# EAGLE design uac (EAGLE 6.5.0)
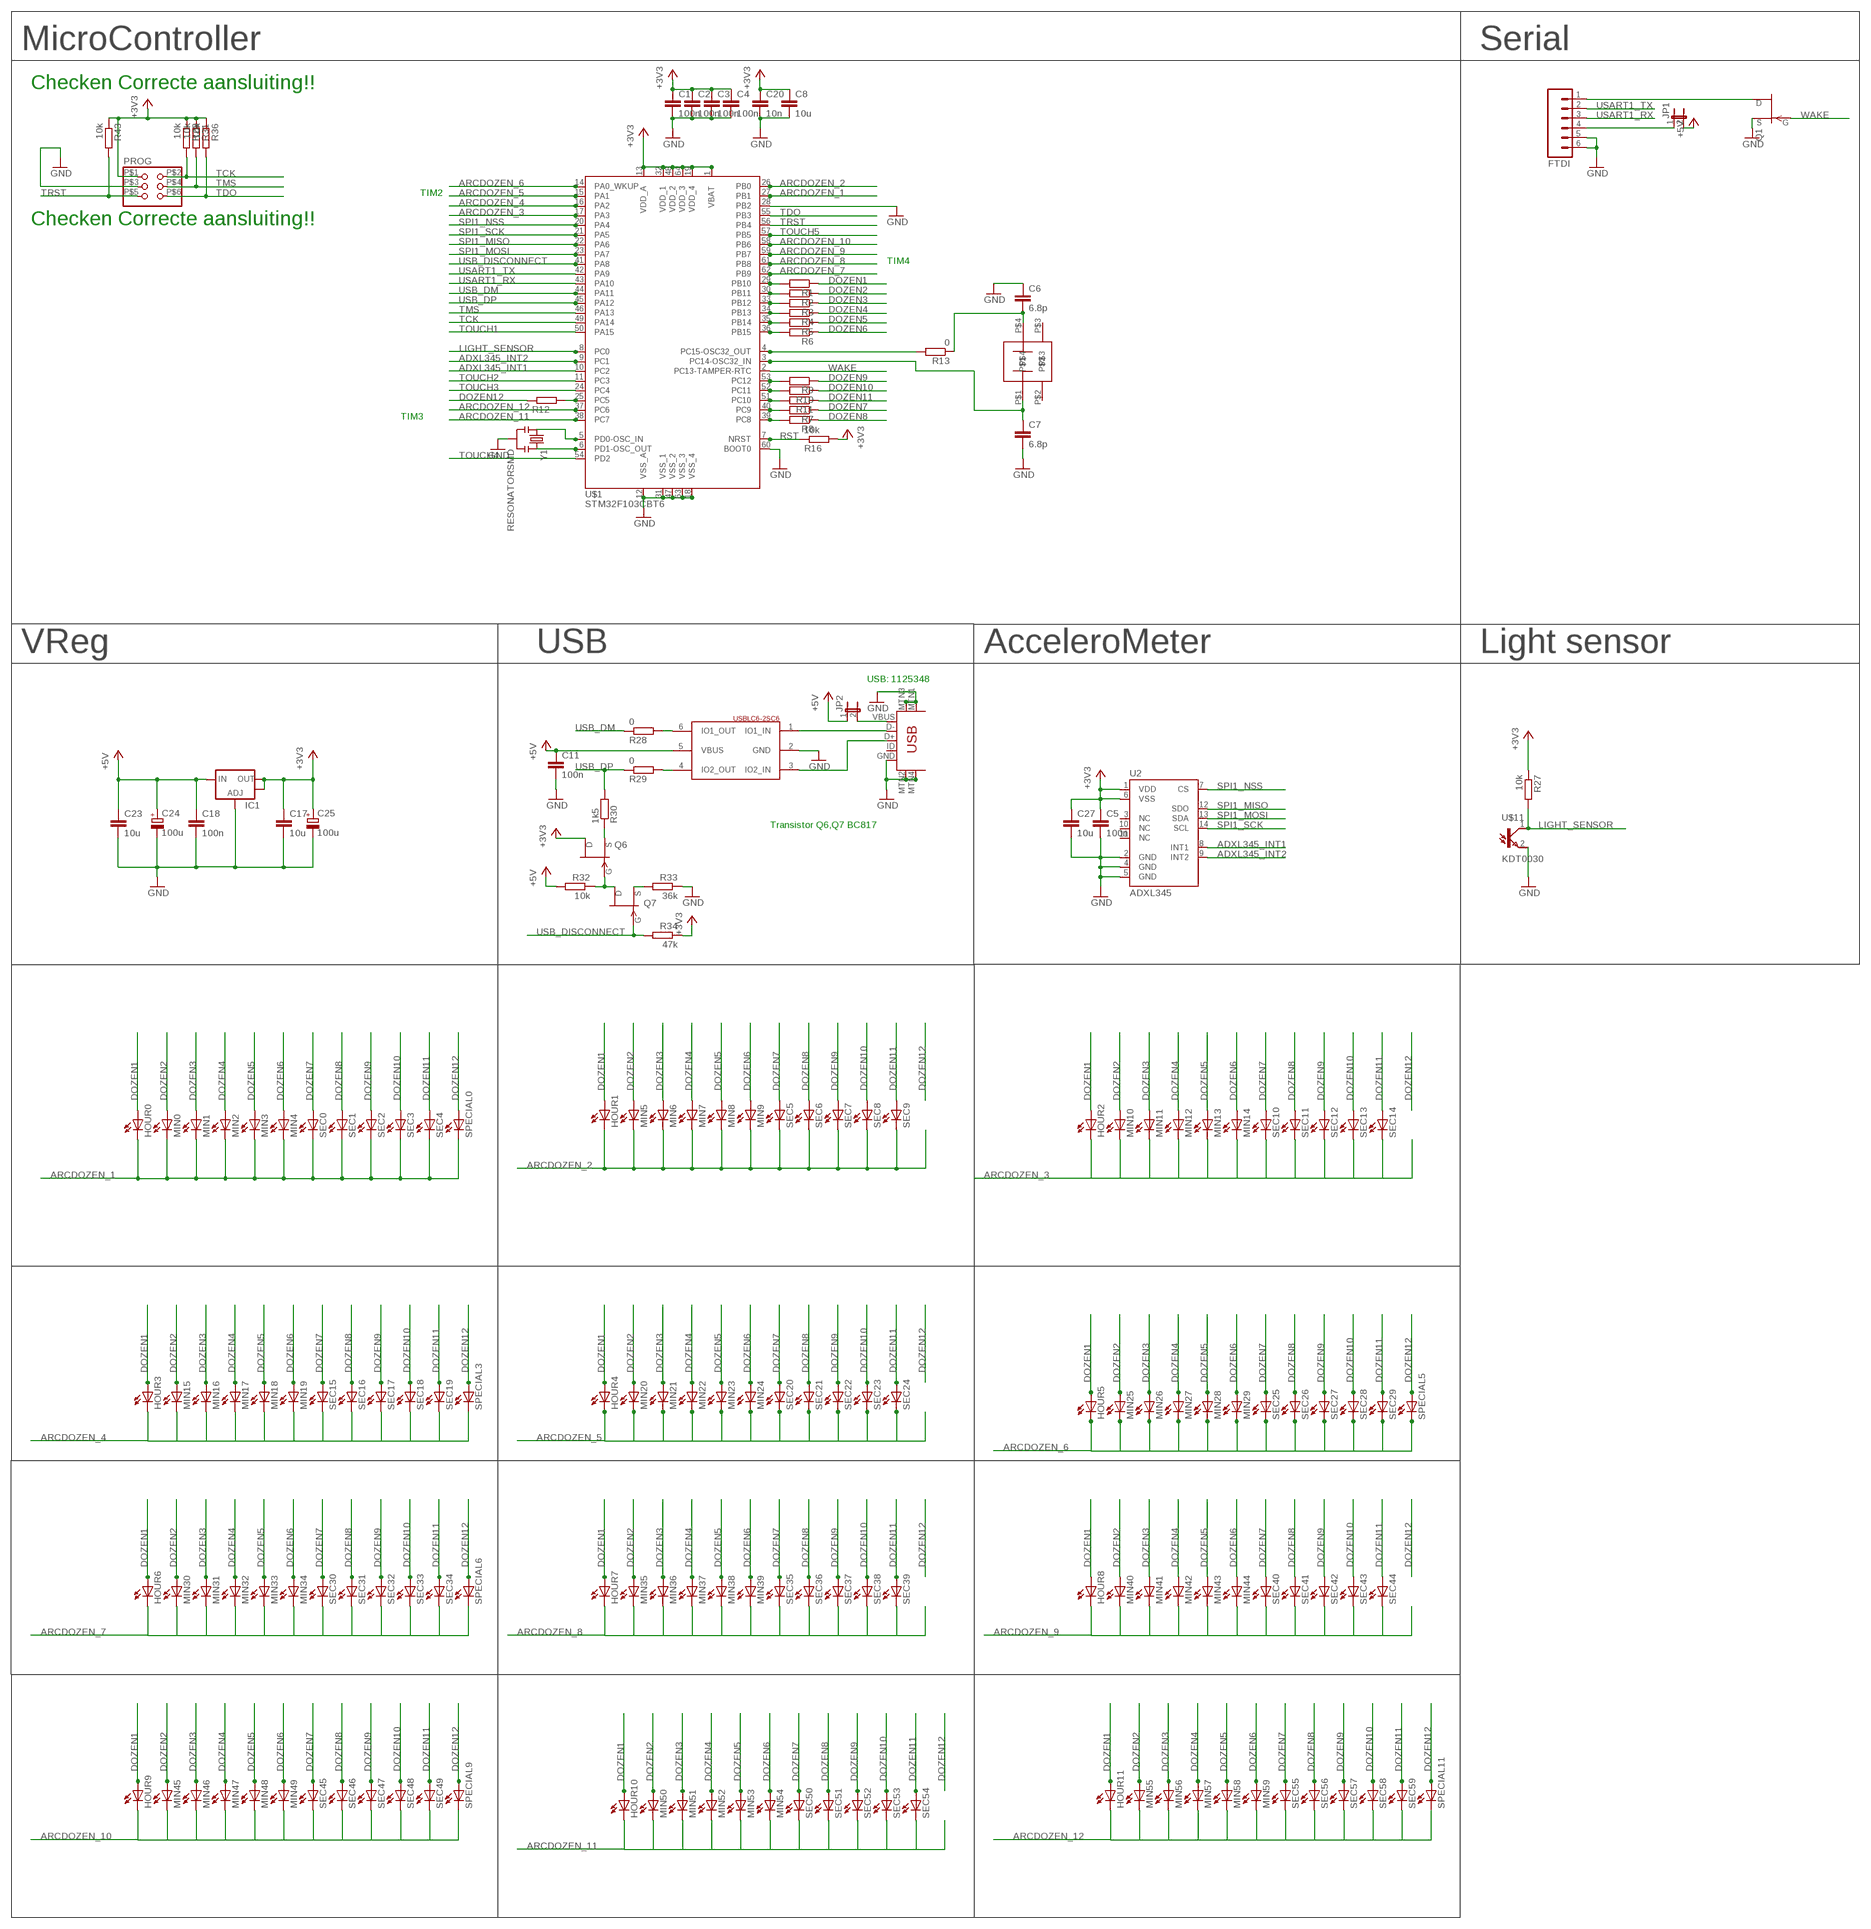
[diagram p0: schematic, sheet 1]

## Parts
C1  100n  C-EUC0603  [C0603]
C2  100n  C-EUC0603  [C0603]
C3  100n  C-EUC0603  [C0603]
C4  100n  C-EUC0603  [C0603]
C5  100n  C-EUC0603  [C0603]
C6  6.8p  C-EUC0603  [C0603]
C7  6.8p  C-EUC0603  [C0603]
C8  10u  C-EUC0603  [C0603]
C11  100n  C-EUC0603  [C0603]
C17  10u  C-EUC0603  [C0603]
C18  100n  C-EUC0603  [C0603]
C20  10n  C-EUC0603  [C0603]
C23  10u  C-EUC0603  [C0603]
C24  100u  CPOL-EUSMCC  [SMC_C]
C25  100u  CPOL-EUSMCC  [SMC_C]
C27  10u  C-EUC0603  [C0603]
FTDI  M06SMD  [1X06-SMD]
HOUR0  LEDCHIPLED_0603  [CHIPLED_0603]
HOUR1  LEDCHIPLED_0603  [CHIPLED_0603]
HOUR2  LEDCHIPLED_0603  [CHIPLED_0603]
HOUR3  LEDCHIPLED_0603  [CHIPLED_0603]
HOUR4  LEDCHIPLED_0603  [CHIPLED_0603]
HOUR5  LEDCHIPLED_0603  [CHIPLED_0603]
HOUR6  LEDCHIPLED_0603  [CHIPLED_0603]
HOUR7  LEDCHIPLED_0603  [CHIPLED_0603]
HOUR8  LEDCHIPLED_0603  [CHIPLED_0603]
HOUR9  LEDCHIPLED_0603  [CHIPLED_0603]
HOUR10  LEDCHIPLED_0603  [CHIPLED_0603]
HOUR11  LEDCHIPLED_0603  [CHIPLED_0603]
IC1  V_REG_LM1117SOT223  [SOT223]
JP1  JUMPER-2SMD-NO  [SJ_2S-NO]
JP2  JUMPER-2SMD-NO  [SJ_2S-NO]
MIN0  LEDCHIPLED_0603  [CHIPLED_0603]
MIN1  LEDCHIPLED_0603  [CHIPLED_0603]
MIN2  LEDCHIPLED_0603  [CHIPLED_0603]
MIN3  LEDCHIPLED_0603  [CHIPLED_0603]
MIN4  LEDCHIPLED_0603  [CHIPLED_0603]
MIN5  LEDCHIPLED_0603  [CHIPLED_0603]
MIN6  LEDCHIPLED_0603  [CHIPLED_0603]
MIN7  LEDCHIPLED_0603  [CHIPLED_0603]
MIN8  LEDCHIPLED_0603  [CHIPLED_0603]
MIN9  LEDCHIPLED_0603  [CHIPLED_0603]
MIN10  LEDCHIPLED_0603  [CHIPLED_0603]
MIN11  LEDCHIPLED_0603  [CHIPLED_0603]
MIN12  LEDCHIPLED_0603  [CHIPLED_0603]
MIN13  LEDCHIPLED_0603  [CHIPLED_0603]
MIN14  LEDCHIPLED_0603  [CHIPLED_0603]
MIN15  LEDCHIPLED_0603  [CHIPLED_0603]
MIN16  LEDCHIPLED_0603  [CHIPLED_0603]
MIN17  LEDCHIPLED_0603  [CHIPLED_0603]
MIN18  LEDCHIPLED_0603  [CHIPLED_0603]
MIN19  LEDCHIPLED_0603  [CHIPLED_0603]
MIN20  LEDCHIPLED_0603  [CHIPLED_0603]
MIN21  LEDCHIPLED_0603  [CHIPLED_0603]
MIN22  LEDCHIPLED_0603  [CHIPLED_0603]
MIN23  LEDCHIPLED_0603  [CHIPLED_0603]
MIN24  LEDCHIPLED_0603  [CHIPLED_0603]
MIN25  LEDCHIPLED_0603  [CHIPLED_0603]
MIN26  LEDCHIPLED_0603  [CHIPLED_0603]
MIN27  LEDCHIPLED_0603  [CHIPLED_0603]
MIN28  LEDCHIPLED_0603  [CHIPLED_0603]
MIN29  LEDCHIPLED_0603  [CHIPLED_0603]
MIN30  LEDCHIPLED_0603  [CHIPLED_0603]
MIN31  LEDCHIPLED_0603  [CHIPLED_0603]
MIN32  LEDCHIPLED_0603  [CHIPLED_0603]
MIN33  LEDCHIPLED_0603  [CHIPLED_0603]
MIN34  LEDCHIPLED_0603  [CHIPLED_0603]
MIN35  LEDCHIPLED_0603  [CHIPLED_0603]
MIN36  LEDCHIPLED_0603  [CHIPLED_0603]
MIN37  LEDCHIPLED_0603  [CHIPLED_0603]
MIN38  LEDCHIPLED_0603  [CHIPLED_0603]
MIN39  LEDCHIPLED_0603  [CHIPLED_0603]
MIN40  LEDCHIPLED_0603  [CHIPLED_0603]
MIN41  LEDCHIPLED_0603  [CHIPLED_0603]
MIN42  LEDCHIPLED_0603  [CHIPLED_0603]
MIN43  LEDCHIPLED_0603  [CHIPLED_0603]
MIN44  LEDCHIPLED_0603  [CHIPLED_0603]
MIN45  LEDCHIPLED_0603  [CHIPLED_0603]
MIN46  LEDCHIPLED_0603  [CHIPLED_0603]
MIN47  LEDCHIPLED_0603  [CHIPLED_0603]
MIN48  LEDCHIPLED_0603  [CHIPLED_0603]
MIN49  LEDCHIPLED_0603  [CHIPLED_0603]
MIN50  LEDCHIPLED_0603  [CHIPLED_0603]
MIN51  LEDCHIPLED_0603  [CHIPLED_0603]
MIN52  LEDCHIPLED_0603  [CHIPLED_0603]
MIN53  LEDCHIPLED_0603  [CHIPLED_0603]
MIN54  LEDCHIPLED_0603  [CHIPLED_0603]
MIN55  LEDCHIPLED_0603  [CHIPLED_0603]
MIN56  LEDCHIPLED_0603  [CHIPLED_0603]
MIN57  LEDCHIPLED_0603  [CHIPLED_0603]
MIN58  LEDCHIPLED_0603  [CHIPLED_0603]
MIN59  LEDCHIPLED_0603  [CHIPLED_0603]
PROG  PINHD-2X3SMT  [2X03_SMT]
Q1  2N7002CK4SST  [SOT23]
Q6  2N7002CK4SST  [SOT23]
Q7  2N7002CK4SST  [SOT23]
R1  R-EU_R0603  [R0603]
R2  R-EU_R0603  [R0603]
R3  R-EU_R0603  [R0603]
R4  R-EU_R0603  [R0603]
R5  R-EU_R0603  [R0603]
R6  R-EU_R0603  [R0603]
R7  R-EU_R0603  [R0603]
R8  R-EU_R0603  [R0603]
R9  R-EU_R0603  [R0603]
R10  R-EU_R0603  [R0603]
R11  R-EU_R0603  [R0603]
R12  R-EU_R0603  [R0603]
R13  0  R-EU_R0603  [R0603]
R16  10k  R-EU_R0603  [R0603]
R23  10k  R-EU_R0603  [R0603]
R27  10k  R-EU_R0603  [R0603]
R28  0  R-EU_R0603  [R0603]
R29  0  R-EU_R0603  [R0603]
R30  1k5  R-EU_R0603  [R0603]
R31  10k  R-EU_R0603  [R0603]
R32  10k  R-EU_R0603  [R0603]
R33  36k  R-EU_R0603  [R0603]
R34  47k  R-EU_R0603  [R0603]
R36  10k  R-EU_R0603  [R0603]
R43  10k  R-EU_R0603  [R0603]
SEC0  LEDCHIPLED_0603  [CHIPLED_0603]
SEC1  LEDCHIPLED_0603  [CHIPLED_0603]
SEC2  LEDCHIPLED_0603  [CHIPLED_0603]
SEC3  LEDCHIPLED_0603  [CHIPLED_0603]
SEC4  LEDCHIPLED_0603  [CHIPLED_0603]
SEC5  LEDCHIPLED_0603  [CHIPLED_0603]
SEC6  LEDCHIPLED_0603  [CHIPLED_0603]
SEC7  LEDCHIPLED_0603  [CHIPLED_0603]
SEC8  LEDCHIPLED_0603  [CHIPLED_0603]
SEC9  LEDCHIPLED_0603  [CHIPLED_0603]
SEC10  LEDCHIPLED_0603  [CHIPLED_0603]
SEC11  LEDCHIPLED_0603  [CHIPLED_0603]
SEC12  LEDCHIPLED_0603  [CHIPLED_0603]
SEC13  LEDCHIPLED_0603  [CHIPLED_0603]
SEC14  LEDCHIPLED_0603  [CHIPLED_0603]
SEC15  LEDCHIPLED_0603  [CHIPLED_0603]
SEC16  LEDCHIPLED_0603  [CHIPLED_0603]
SEC17  LEDCHIPLED_0603  [CHIPLED_0603]
SEC18  LEDCHIPLED_0603  [CHIPLED_0603]
SEC19  LEDCHIPLED_0603  [CHIPLED_0603]
SEC20  LEDCHIPLED_0603  [CHIPLED_0603]
SEC21  LEDCHIPLED_0603  [CHIPLED_0603]
SEC22  LEDCHIPLED_0603  [CHIPLED_0603]
SEC23  LEDCHIPLED_0603  [CHIPLED_0603]
SEC24  LEDCHIPLED_0603  [CHIPLED_0603]
SEC25  LEDCHIPLED_0603  [CHIPLED_0603]
SEC26  LEDCHIPLED_0603  [CHIPLED_0603]
SEC27  LEDCHIPLED_0603  [CHIPLED_0603]
SEC28  LEDCHIPLED_0603  [CHIPLED_0603]
SEC29  LEDCHIPLED_0603  [CHIPLED_0603]
SEC30  LEDCHIPLED_0603  [CHIPLED_0603]
SEC31  LEDCHIPLED_0603  [CHIPLED_0603]
SEC32  LEDCHIPLED_0603  [CHIPLED_0603]
SEC33  LEDCHIPLED_0603  [CHIPLED_0603]
SEC34  LEDCHIPLED_0603  [CHIPLED_0603]
SEC35  LEDCHIPLED_0603  [CHIPLED_0603]
SEC36  LEDCHIPLED_0603  [CHIPLED_0603]
SEC37  LEDCHIPLED_0603  [CHIPLED_0603]
SEC38  LEDCHIPLED_0603  [CHIPLED_0603]
SEC39  LEDCHIPLED_0603  [CHIPLED_0603]
SEC40  LEDCHIPLED_0603  [CHIPLED_0603]
SEC41  LEDCHIPLED_0603  [CHIPLED_0603]
SEC42  LEDCHIPLED_0603  [CHIPLED_0603]
SEC43  LEDCHIPLED_0603  [CHIPLED_0603]
SEC44  LEDCHIPLED_0603  [CHIPLED_0603]
SEC45  LEDCHIPLED_0603  [CHIPLED_0603]
SEC46  LEDCHIPLED_0603  [CHIPLED_0603]
SEC47  LEDCHIPLED_0603  [CHIPLED_0603]
SEC48  LEDCHIPLED_0603  [CHIPLED_0603]
SEC49  LEDCHIPLED_0603  [CHIPLED_0603]
SEC50  LEDCHIPLED_0603  [CHIPLED_0603]
SEC51  LEDCHIPLED_0603  [CHIPLED_0603]
SEC52  LEDCHIPLED_0603  [CHIPLED_0603]
SEC53  LEDCHIPLED_0603  [CHIPLED_0603]
SEC54  LEDCHIPLED_0603  [CHIPLED_0603]
SEC55  LEDCHIPLED_0603  [CHIPLED_0603]
SEC56  LEDCHIPLED_0603  [CHIPLED_0603]
SEC57  LEDCHIPLED_0603  [CHIPLED_0603]
SEC58  LEDCHIPLED_0603  [CHIPLED_0603]
SEC59  LEDCHIPLED_0603  [CHIPLED_0603]
SPECIAL0  LEDCHIPLED_0603  [CHIPLED_0603]
SPECIAL3  LEDCHIPLED_0603  [CHIPLED_0603]
SPECIAL5  LEDCHIPLED_0603  [CHIPLED_0603]
SPECIAL6  LEDCHIPLED_0603  [CHIPLED_0603]
SPECIAL9  LEDCHIPLED_0603  [CHIPLED_0603]
SPECIAL11  LEDCHIPLED_0603  [CHIPLED_0603]
U2  ADXL345  [LGA14]
U$1  STM32F103CBT6  [LQFP64]
U$2  CRYSTAL_32KHZ  [CRYSTAL_32KHZ]
U$11  KDT0030  [FLD00030]
U$12  USB-MINIB-5PIN  [USB-MINIB]
U$13  USBLC6-2SC6  [SOT23]
Y1  RESONATORSMD  [RESONATOR-SMD]

## Nets
+3V3: C1.1 C2.1 C3.1 C4.1 C5.1 C8.1 C17.1 C20.1 C25.+ C27.1 IC1.2(OUT) IC1.4(OUT) PROG.P$1 Q6.3(D) R16.2 R23.1 R27.1 R31.1 R34.1 R36.1 R43.1 U2.1(VDD) U2.6(VSS) U$1.1(VBAT) U$1.13(VDD_A) U$1.19(VDD_4) U$1.32(VDD_1) U$1.48(VDD_2) U$1.64(VDD_3)
+5V: C11.1 C18.1 C23.1 C24.+ IC1.3(IN) JP1.2 JP2.1 R32.2 U$13.5(VBUS)
ADXL345_INT1: U2.8(INT1) U$1.10(PC2)
ADXL345_INT2: U2.9(INT2) U$1.9(PC1)
ARCDOZEN_1: HOUR0.C MIN0.C MIN1.C MIN2.C MIN3.C MIN4.C SEC0.C SEC1.C SEC2.C SEC3.C SEC4.C SPECIAL0.C U$1.27(PB1)
ARCDOZEN_2: HOUR1.C MIN5.C MIN6.C MIN7.C MIN8.C MIN9.C SEC5.C SEC6.C SEC7.C SEC8.C SEC9.C U$1.26(PB0)
ARCDOZEN_3: HOUR2.C MIN10.C MIN11.C MIN12.C MIN13.C MIN14.C SEC10.C SEC11.C SEC12.C SEC13.C SEC14.C U$1.17(PA3)
ARCDOZEN_4: HOUR3.C MIN15.C MIN16.C MIN17.C MIN18.C MIN19.C SEC15.C SEC16.C SEC17.C SEC18.C SEC19.C SPECIAL3.C U$1.16(PA2)
ARCDOZEN_5: HOUR4.C MIN20.C MIN21.C MIN22.C MIN23.C MIN24.C SEC20.C SEC21.C SEC22.C SEC23.C SEC24.C U$1.15(PA1)
ARCDOZEN_6: HOUR5.C MIN25.C MIN26.C MIN27.C MIN28.C MIN29.C SEC25.C SEC26.C SEC27.C SEC28.C SEC29.C SPECIAL5.C U$1.14(PA0_WKUP)
ARCDOZEN_7: HOUR6.C MIN30.C MIN31.C MIN32.C MIN33.C MIN34.C SEC30.C SEC31.C SEC32.C SEC33.C SEC34.C SPECIAL6.C U$1.62(PB9)
ARCDOZEN_8: HOUR7.C MIN35.C MIN36.C MIN37.C MIN38.C MIN39.C SEC35.C SEC36.C SEC37.C SEC38.C SEC39.C U$1.61(PB8)
ARCDOZEN_9: HOUR8.C MIN40.C MIN41.C MIN42.C MIN43.C MIN44.C SEC40.C SEC41.C SEC42.C SEC43.C SEC44.C U$1.59(PB7)
ARCDOZEN_10: HOUR9.C MIN45.C MIN46.C MIN47.C MIN48.C MIN49.C SEC45.C SEC46.C SEC47.C SEC48.C SEC49.C SPECIAL9.C U$1.58(PB6)
ARCDOZEN_11: HOUR10.C MIN50.C MIN51.C MIN52.C MIN53.C MIN54.C SEC50.C SEC51.C SEC52.C SEC53.C SEC54.C U$1.38(PC7)
ARCDOZEN_12: HOUR11.C MIN55.C MIN56.C MIN57.C MIN58.C MIN59.C SEC55.C SEC56.C SEC57.C SEC58.C SEC59.C SPECIAL11.C U$1.37(PC6)
DOZEN1: HOUR0.A HOUR1.A HOUR2.A HOUR3.A HOUR4.A HOUR5.A HOUR6.A HOUR7.A HOUR8.A HOUR9.A HOUR10.A HOUR11.A R1.1
DOZEN2: MIN0.A MIN5.A MIN10.A MIN15.A MIN20.A MIN25.A MIN30.A MIN35.A MIN40.A MIN45.A MIN50.A MIN55.A R2.1
DOZEN3: MIN1.A MIN6.A MIN11.A MIN16.A MIN21.A MIN26.A MIN31.A MIN36.A MIN41.A MIN46.A MIN51.A MIN56.A R3.1
DOZEN4: MIN2.A MIN7.A MIN12.A MIN17.A MIN22.A MIN27.A MIN32.A MIN37.A MIN42.A MIN47.A MIN52.A MIN57.A R4.1
DOZEN5: MIN3.A MIN8.A MIN13.A MIN18.A MIN23.A MIN28.A MIN33.A MIN38.A MIN43.A MIN48.A MIN53.A MIN58.A R5.1
DOZEN6: MIN4.A MIN9.A MIN14.A MIN19.A MIN24.A MIN29.A MIN34.A MIN39.A MIN44.A MIN49.A MIN54.A MIN59.A R6.1
DOZEN7: R7.1 SEC0.A SEC5.A SEC10.A SEC15.A SEC20.A SEC25.A SEC30.A SEC35.A SEC40.A SEC45.A SEC50.A SEC55.A
DOZEN8: R8.1 SEC1.A SEC6.A SEC11.A SEC16.A SEC21.A SEC26.A SEC31.A SEC36.A SEC41.A SEC46.A SEC51.A SEC56.A
DOZEN9: R9.1 SEC2.A SEC7.A SEC12.A SEC17.A SEC22.A SEC27.A SEC32.A SEC37.A SEC42.A SEC47.A SEC52.A SEC57.A
DOZEN10: R10.1 SEC3.A SEC8.A SEC13.A SEC18.A SEC23.A SEC28.A SEC33.A SEC38.A SEC43.A SEC48.A SEC53.A SEC58.A
DOZEN11: R11.1 SEC4.A SEC9.A SEC14.A SEC19.A SEC24.A SEC29.A SEC34.A SEC39.A SEC44.A SEC49.A SEC54.A SEC59.A
DOZEN12: R12.1 SPECIAL0.A SPECIAL3.A SPECIAL5.A SPECIAL6.A SPECIAL9.A SPECIAL11.A
GND: C1.2 C2.2 C3.2 C4.2 C5.2 C6.1 C7.2 C8.2 C11.2 C17.2 C18.2 C20.2 C23.2 C24.- C25.- C27.2 FTDI.5 FTDI.6 IC1.1(ADJ) PROG.P$3 Q1.2(S) R33.1 U2.2(GND) U2.4(GND) U2.5(GND) U$1.12(VSS_A) U$1.18(VSS_4) U$1.28(PB2) U$1.31(VSS_1) U$1.47(VSS_2) U$1.60(BOOT0) U$1.63(VSS_3) U$11.2(EMI) U$12.GND U$12.MTN1(MTN2) U$12.MTN2(MTN3) U$12.MTN3(MTN1) U$12.MTN4 U$13.2(GND) Y1.2
LIGHT_SENSOR: R27.2 U$1.8(PC0) U$11.1(COL)
N$1: U$1.6(PD1-OSC_OUT) Y1.3
N$2: U$1.5(PD0-OSC_IN) Y1.1
N$3: JP2.2 U$12.VBUS
N$4: R13.2 U$1.4(PC15-OSC32_OUT)
N$5: C6.2 R13.1 U$2.P$4
N$6: C7.1 U$1.3(PC14-OSC32_IN) U$2.P$1
N$7: R1.2 U$1.29(PB10)
N$8: R2.2 U$1.30(PB11)
N$9: R3.2 U$1.33(PB12)
N$10: R4.2 U$1.34(PB13)
N$11: R5.2 U$1.35(PB14)
N$12: R6.2 U$1.36(PB15)
N$13: R7.2 U$1.40(PC9)
N$14: R8.2 U$1.39(PC8)
N$15: R9.2 U$1.53(PC12)
N$16: R10.2 U$1.52(PC11)
N$17: R11.2 U$1.51(PC10)
N$18: U$12.D- U$13.1(IO1_IN)
N$19: FTDI.4 JP1.1
N$20: FTDI.1 Q1.3(D)
N$34: U$12.D+ U$13.3(IO2_IN)
N$35: R12.2 U$1.25(PC5)
N$36: R28.2 U$13.6(IO1_OUT)
N$37: R29.2 U$13.4(IO2_OUT)
N$38: Q6.2(S) R30.1
N$39: Q6.1(G) Q7.3(D) R32.1
N$40: Q7.2(S) R33.2
RST: R16.1 U$1.7(NRST)
SPI1_MISO: U2.12(SDO) U$1.22(PA6)
SPI1_MOSI: U2.13(SDA) U$1.23(PA7)
SPI1_NSS: U2.7(CS) U$1.20(PA4)
SPI1_SCK: U2.14(SCL) U$1.21(PA5)
TCK: PROG.P$2 R23.2 U$1.49(PA14)
TDO: PROG.P$6 R36.2 U$1.55(PB3)
TMS: PROG.P$4 R31.2 U$1.46(PA13)
TOUCH1: U$1.50(PA15)
TOUCH2: U$1.11(PC3)
TOUCH3: U$1.24(PC4)
TOUCH4: U$1.54(PD2)
TOUCH5: U$1.57(PB5)
TRST: PROG.P$5 R43.2 U$1.56(PB4)
USART1_RX: FTDI.3 U$1.43(PA10)
USART1_TX: FTDI.2 U$1.42(PA9)
USB_DISCONNECT: Q7.1(G) R34.2 U$1.41(PA8)
USB_DM: R28.1 U$1.44(PA11)
USB_DP: R29.1 R30.2 U$1.45(PA12)
WAKE: Q1.1(G) U$1.2(PC13-TAMPER-RTC)
Unconnected: U2.3(NC) U2.10(NC) U2.11(NC) U$2.P$2 U$2.P$3 U$12.ID

## Notes on the sheet
- MicroController | Serial
- Checken Correcte aansluiting!!
- TIM2
- Checken Correcte aansluiting!!
- TIM4
- TIM3
- VReg | USB | AcceleroMeter | Light sensor
- USB: 1125348
- Transistor Q6,Q7 BC817

## Library data of the parts
C1-C8 C11 C17 C18 C20 C23 C27 = Custom components:C-EU: CAPACITOR, European symbol
C24 C25 = Custom components:CPOL-EU: POLARIZED CAPACITOR, European symbol
FTDI = Custom components:M06: Header 6 Standard 6-pin 0.1" header. Use with straight break away headers (SKU : PRT-00116), right angle break away headers (PRT-00553), swiss pins (PRT-00743), machine pins (PRT-00117), and female headers (PRT-00115). Molex polarized connector foot print use with SKU : PRT-08094 with associated crimp pins and housings. NOTES ON THE VARIANTS LOCK and LOCK_LONGPADS... This footprint was designed to help hold the alignment of a through-hole component (i.e. 6-pin header) while soldering it into place. You may notice that each hole has been shifted either up or down by 0.005 of an inch from it's more standard position (which is a perfectly straight line). This slight alteration caused the pins (the squares in the middle) to touch the edges of the holes. Because they are alternating, it causes a "brace" to hold the component in place. 0.005 has proven to be the perfect amount of "off-center" position when using our standard breakaway headers. Although looks a little odd when you look at the bare footprint, once you have a header in there, the alteration is very hard to notice. Also, if you push a header all the way into place, it is covered up entirely on the bottom side. This idea of altering the position of holes to aid alignment will be further integrated into the Sparkfun Library for other footprints. It can help hold any component with 3 or more connection pins.
HOUR0 HOUR1-HOUR11 MIN0 MIN1-MIN59 SEC0 SEC1-SEC59 SPECIAL0 SPECIAL3 SPECIAL5 SPECIAL6 SPECIAL9 SPECIAL11 = timearc:LED: LED OSRAM: - CHIPLED LG R971, LG N971, LY N971, LG Q971, LY Q971, LO R971, LY R971 LH N974, LH R974 LS Q976, LO Q976, LY Q976 LO Q996 - Hyper CHIPLED LW Q18S LB Q993, LB Q99A, LB R99A - SideLED LS A670, LO A670, LY A670, LG A670, LP A670 LB A673, LV A673, LT A673, LW A673 LH A674 LY A675 LS A676, LA A676, LO A676, LY A676, LW A676 LS A679, LY A679, LG A679 - Hyper Micro SIDELED® LS Y876, LA Y876, LO Y876, LY Y876 LT Y87S - SmartLED LW L88C, LW L88S LB L89C, LB L89S, LG L890 LS L89K, LO L89K, LY L89K LS L896, LA L896, LO L896, LY L896 - TOPLED LS T670, LO T670, LY T670, LG T670, LP T670 LSG T670, LSP T670, LSY T670, LOP T670, LYG T670 LG T671, LOG T671, LSG T671 LB T673, LV T673, LT T673, LW T673 LH T674 LS T676, LA T676, LO T676, LY T676, LB T676, LH T676, LSB T676, LW T676 LB T67C, LV T67C, LT T67C, LS T67K, LO T67K, LY T67K, LW E67C LS E67B, LA E67B, LO E67B, LY E67B, LB E67C, LV E67C, LT E67C LW T67C LS T679, LY T679, LG T679 LS T770, LO T770, LY T770, LG T770, LP T770 LB T773, LV T773, LT T773, LW T773 LH T774 LS E675, LA E675, LY E675, LS T675 LS T776, LA T776, LO T776, LY T776, LB T776 LHGB T686 LT T68C, LB T68C - Hyper Mini TOPLED® LB M676 - Mini TOPLED Santana® LG M470 LS M47K, LO M47K, LY M47K Source: http://www.osram.convergy.de LUXEON: - LUMILED® LXK2-PW12-R00, LXK2-PW12-S00, LXK2-PW14-U00, LXK2-PW14-V00 LXK2-PM12-R00, LXK2-PM12-S00, LXK2-PM14-U00 LXK2-PE12-Q00, LXK2-PE12-R00, LXK2-PE12-S00, LXK2-PE14-T00, LXK2-PE14-U00 LXK2-PB12-K00, LXK2-PB12-L00, LXK2-PB12-M00, LXK2-PB14-N00, LXK2-PB14-P00, LXK2-PB14-Q00 LXK2-PR12-L00, LXK2-PR12-M00, LXK2-PR14-Q00, LXK2-PR14-R00 LXK2-PD12-Q00, LXK2-PD12-R00, LXK2-PD12-S00 LXK2-PH12-R00, LXK2-PH12-S00 LXK2-PL12-P00, LXK2-PL12-Q00, LXK2-PL12-R00 Source: www.luxeon.com KINGBRIGHT: KA-3528ASYC Source: www.kingbright.com
IC1 = Custom components:V_REG_LM1117: Voltage Regulator LM1117 Standard adjustable voltage regulator but in SMD form. Spark Fun Electronics SKU : COM-00595
JP1 JP2 = SparkFun2012:JUMPER-2: Jumper Basic 0.1" spaced jumper. Use with breakaway headers.
PROG = Custom components:PINHD-2X3: PIN HEADER
Q1 Q6 Q7 = Custom components:2N7002CK: N-Channel JFETs farnell: 1829183 Source: VISHAY 2N5484.pdf Compatible: TO92 2N5245 J304 J305 U310 J308 J309 J310 TO72 2N4416 2N4416A 2N3823 2N4351 3N169 3N170 3N171 MFE3002 TO18 2N3796 2N3797 MFE825 Source: Motorola European Master Guide Pacge 3-59
R1-R13 R16 R23 R27-R34 R36 R43 = Custom components:R-EU_: RESISTOR, European symbol
U2 = SparkFun2012:ADXL345
U$1 = timearc:STM32F103CBT6
U$2 = timearc:CRYSTAL_32KHZ; MPN: MC-306 32.768K-E3:ROHS; OC_DIGIKEY_1: SER2417TR-ND
U$11 = timearc:KDT0030: Updated Light Sensor The KDT00030 is a small, low profile photo detector. It incorporates a phototransistor detector chip which makes it an ideal choice for low cost ambient light measurement applications like mobile appliances backlighting.; MPN: KDT00030TR; OC_DIGIKEY_1000: KDT00030FSCT-ND; U_PRICE_1: 0.60 USD; U_PRICE_1000: 0.19814 USD
U$12 = SparkFun2012:USB-MINIB: Mini-USB "B" connector with 5th pin broken out. Created new symbol breaking out 5th "ID" pin in mini/micro USB connector spec. See: http://en.wikipedia.org/wiki/Mini_usb#Cables. Uses same footprint as 4-pin symbol. Also added pins to connect to mounting / shield pads if required (probably not generally needed as signals aren't shielded once they leave the connector).
U$13 = timearc:USBLC6-2SC6; MPN: USBLC6-2SC6; OC_FARNELL: 1269406
Y1 = Custom components:RESONATOR: Resonator Small SMD resonator. This is the itty bitty 10/20MHz resonators with built in caps. CSTCE10M0G55 and CSTCE20M0V53. Footprint has been reviewed closely but hasn't been tested yet.

## Net classes
0 default: width 0.152 mm, drill 0.305 mm, clearance 0.152 mm

## Board
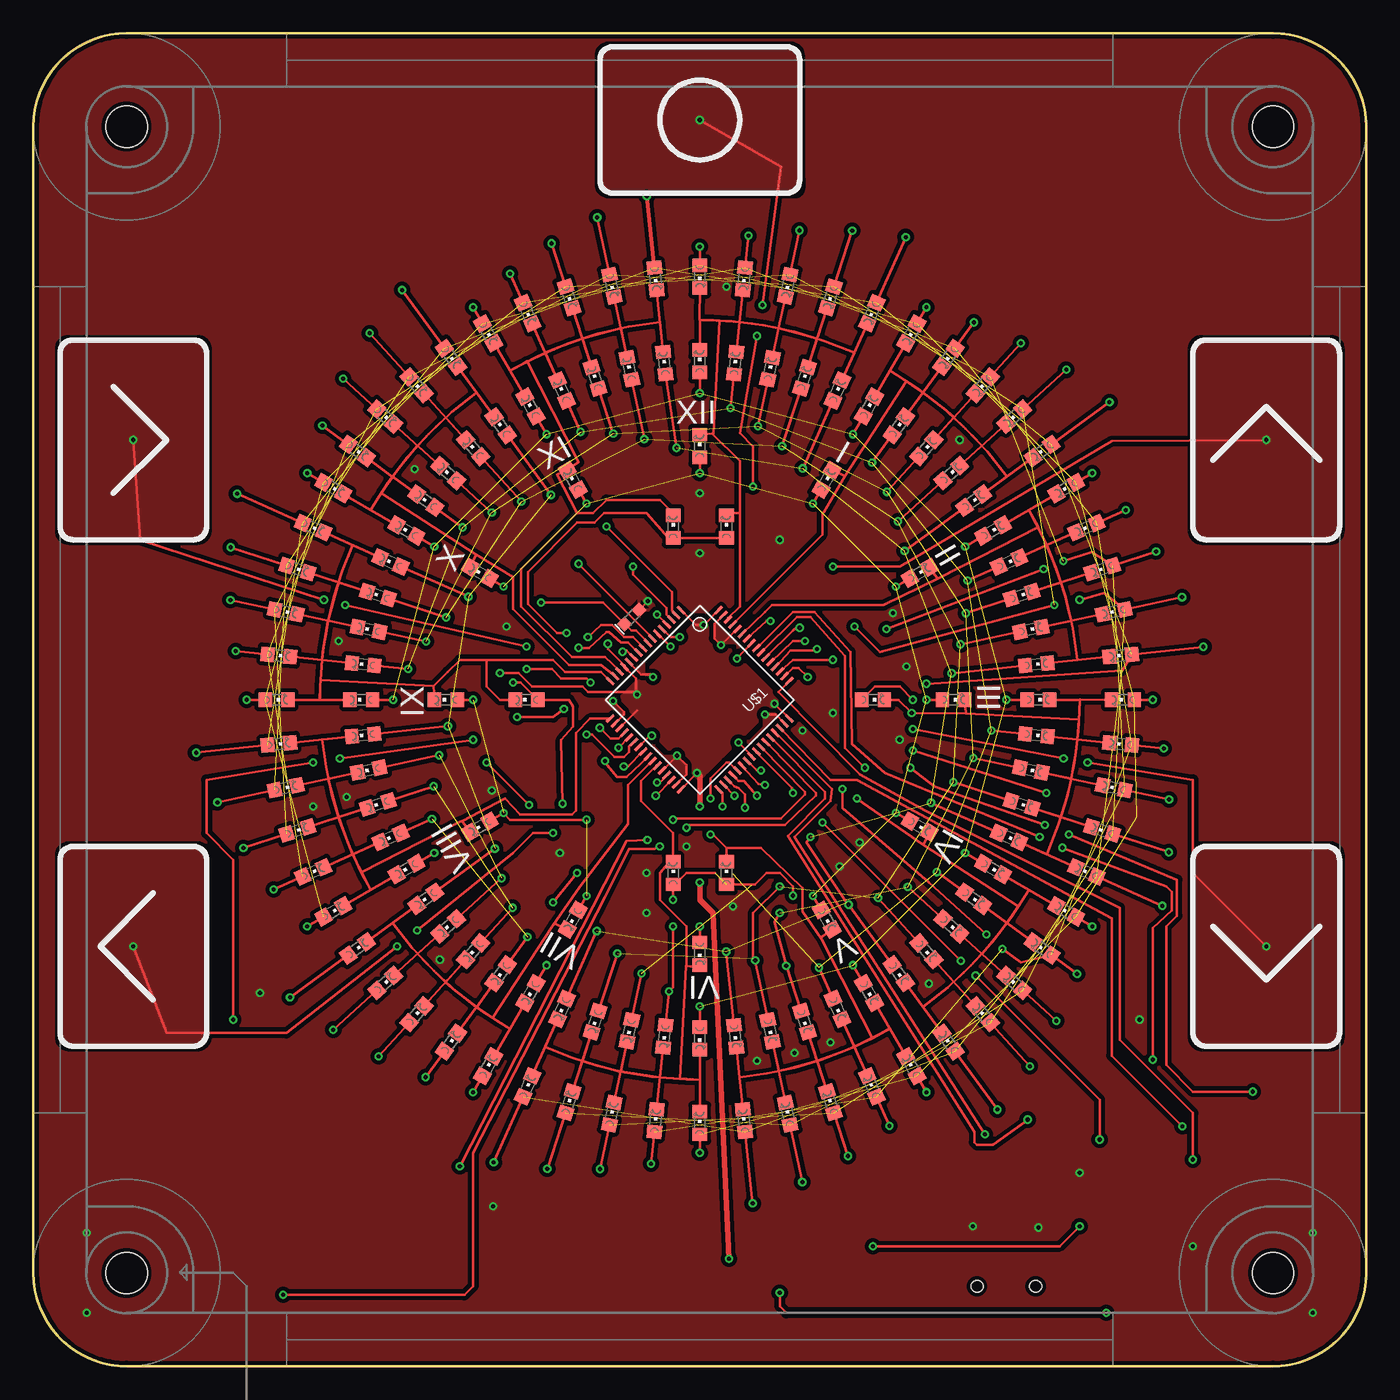
[diagram p1: board, top side]
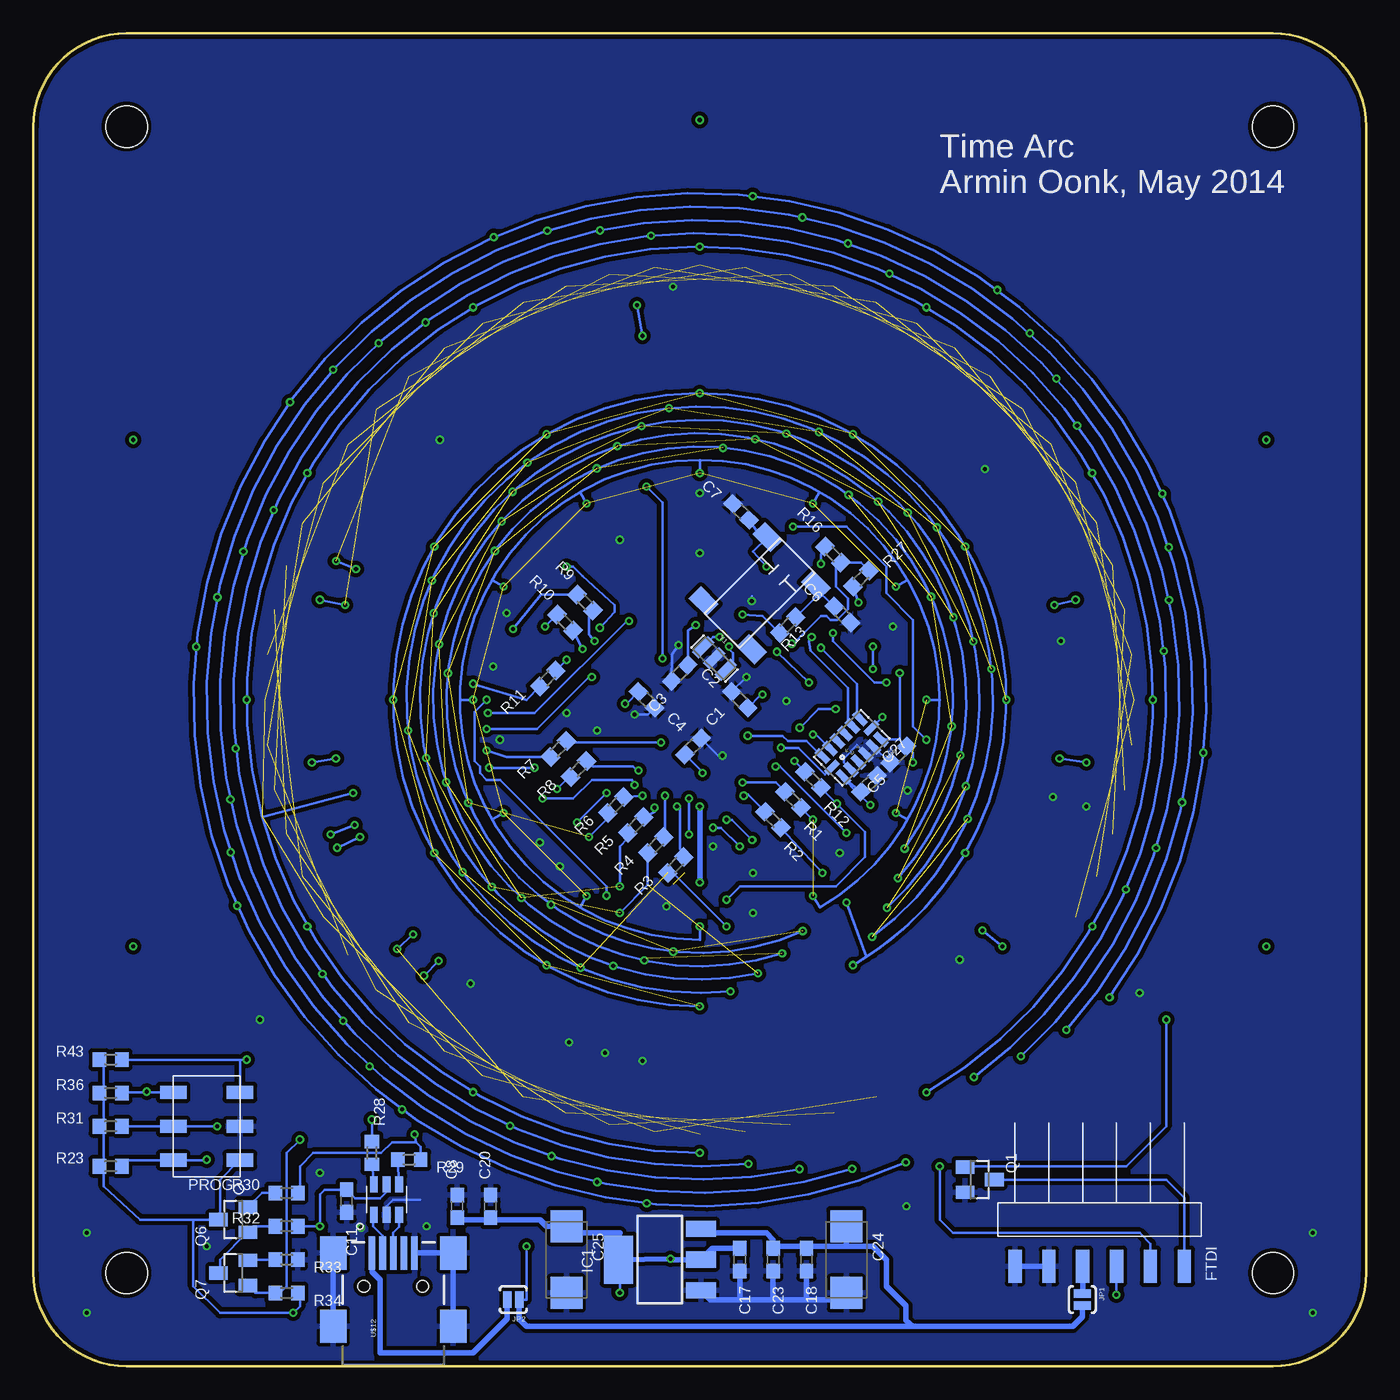
[diagram p2: board, bottom side, seen from below]

Size 100 x 100 mm. Coordinates in mm from the lower left corner, seen from the top.
Outline: 93,100 7,100 arc90 0,93 0,7 arc90 7,0 93,0 arc90 100,7 100,93 arc90 93,100
Copper layers (1*16): Top 0.035mm / dielectric 1.5mm / Bottom 0.035mm
Design rules "dirt_cheap_dirty_boards.v1": minimum track width 5mil, minimum drill 12mil, track to track 5mil, track to pad 5mil, pad to pad 5mil, via to via 5mil, smd to smd 0mil, copper to edge 10mil, drill to drill 10mil, minimum pad ring 10mil, minimum via ring 6mil, stop-mask expansion 2mil, vias tented up to drill 25mil, thermal gap 10mil
Holes 3.1 mm at 93,7 7,7 93,93 7,93

### Footprints (pad centres in the part's own frame; a part is rotated, then mirrored left to right if it is on the bottom)
C0603 = smd 1.1 x 1: 1 -0.85,0; 2 0.85,0
SMC_C = smd 2.4 x 2.4: + -2.5,0; - 2.5,0
1X06-SMD = smd 1 x 2.5: 1 6.35,-3.5; 2 3.81,-3.5; 3 1.27,-3.5; 4 -1.27,-3.5; 5 -3.81,-3.5; 6 -6.35,-3.5
CHIPLED_0603 = smd 1.1 x 1: A 0,-0.85; C 0,0.85
SOT223 = smd 1.219 x 2.235: 1 -2.311,-3.099; 2 0,-3.099; 3 2.311,-3.099 | smd 3.6 x 2.2: 4 0,3.099
SJ_2S-NO = smd 0.635 x 1.27: 1 -0.45,0; 2 0.45,0
2X03_SMT = smd 1 x 2: P$1 -2.54,-2.5; P$2 -2.54,2.5; P$3 0,-2.5; P$4 0,2.5; P$5 2.54,-2.5; P$6 2.54,2.5
SOT23 = smd 1 x 1.4: 1 -0.95,-1.1; 2 0.95,-1.1; 3 0,1.1
R0603 = smd 1 x 1.1: 1 -0.85,0; 2 0.85,0
LGA14 = smd 0.5 x 1.2: 1 2,1.1; 2 1.2,1.1; 3 0.4,1.1; 4 -0.4,1.1; 5 -1.2,1.1; 6 -2,1.1; 8 -2,-1.1; 9 -1.2,-1.1; 10 -0.4,-1.1; 11 0.4,-1.1; 12 1.2,-1.1; 13 2,-1.1 | smd 1.2 x 0.5: 7 -2.1,0; 14 2.1,0
LQFP64 = smd 0.203 x 0.762: 1 -3.75,-5.75; 2 -3.25,-5.75; 3 -2.75,-5.75; 4 -2.25,-5.75; 5 -1.75,-5.75; 6 -1.25,-5.75; 7 -0.75,-5.75; 8 -0.25,-5.75; 9 0.25,-5.75; 10 0.75,-5.75; 11 1.25,-5.75; 12 1.75,-5.75; 13 2.25,-5.75; 14 2.75,-5.75; 15 3.25,-5.75; 16 3.75,-5.75; 33 3.75,5.75; 34 3.25,5.75; 35 2.75,5.75; 36 2.25,5.75; 37 1.75,5.75; 38 1.25,5.75; 39 0.75,5.75; 40 0.25,5.75; 41 -0.25,5.75; 42 -0.75,5.75; 43 -1.25,5.75; 44 -1.75,5.75; 45 -2.25,5.75; 46 -2.75,5.75; 47 -3.25,5.75; 48 -3.75,5.75 | smd 0.762 x 0.203: 17 5.75,-3.75; 18 5.75,-3.25; 19 5.75,-2.75; 20 5.75,-2.25; 21 5.75,-1.75; 22 5.75,-1.25; 23 5.75,-0.75; 24 5.75,-0.25; 25 5.75,0.25; 26 5.75,0.75; 27 5.75,1.25; 28 5.75,1.75; 29 5.75,2.25; 30 5.75,2.75; 31 5.75,3.25; 32 5.75,3.75; 49 -5.75,3.75; 50 -5.75,3.25; 51 -5.75,2.75; 52 -5.75,2.25; 53 -5.75,1.75; 54 -5.75,1.25; 55 -5.75,0.75; 56 -5.75,0.25; 57 -5.75,-0.25; 58 -5.75,-0.75; 59 -5.75,-1.25; 60 -5.75,-1.75; 61 -5.75,-2.25; 62 -5.75,-2.75; 63 -5.75,-3.25; 64 -5.75,-3.75
CRYSTAL_32KHZ = smd 1.3 x 1.9: P$1 -3.4,-2.55; P$2 3.4,-2.55; P$3 3.4,2.55; P$4 -3.4,2.55
FLD00030 = smd 0.8 x 0.8: 1 -0.75,0; 2 0.75,0
USB-MINIB = smd 2.5 x 0.5: D+ 2.5,0; D- 2.5,0.8; GND 2.5,-1.6; ID 2.5,-0.8; VBUS 2.5,1.6 | smd 2.5 x 2: MTN1 -3,4.5; MTN2 2.5,4.5; MTN3 -3,-4.5; MTN4 2.5,-4.5 | hole 0.9: 0,2.2; 0,-2.2
SOT23' = smd 0.6 x 1.2: 1 -0.95,-1.15; 2 0,-1.15; 3 0.95,-1.15; 4 0.95,1.15; 5 0,1.15; 6 -0.95,1.15
RESONATOR-SMD = smd 0.7 x 1.7: 1 -1.2,0; 2 0,0; 3 1.2,0

### Placement (x,y rotation side)
C1  50.5,46.5 45 bottom
C2  47,50 135 bottom
C3  51.5,52 225 bottom
C4  54,50 315 bottom
C5  35.1,45.9 225 bottom
C6  39.3,56.4 135 bottom
C7  46.9,64.1 135 bottom
C8  68.2,12 90 bottom
C11  76.5,12.4 270 bottom
C17  47,8 270 bottom
C18  42,8 270 bottom
C20  65.7,12 90 bottom
C23  44.5,8 270 bottom
C24  39,8 270 bottom
C25  60,8 270 bottom
C27  37.3,43.7 45 bottom
FTDI  20,11 0 bottom
HOUR0  50,30.95 180 top
HOUR1  40.48,33.5 150 top
HOUR2  33.5,40.48 120 top
HOUR3  30.95,50 90 top
HOUR4  33.5,59.52 60 top
HOUR5  40.48,66.5 30 top
HOUR6  50,69.05 0 top
HOUR7  59.52,66.5 330 top
HOUR8  66.5,59.52 300 top
HOUR9  69.05,50 270 top
HOUR10  66.5,40.48 240 top
HOUR11  59.52,33.5 210 top
IC1  53,8 90 bottom
JP1  21.3,5 270 bottom
JP2  64,5 180 bottom
MIN0  50,24.6 180 top
MIN1  47.34,24.74 174 top
MIN2  44.72,25.16 168 top
MIN3  42.15,25.84 162 top
MIN4  39.67,26.8 156 top
MIN5  37.3,28 150 top
MIN6  35.07,29.45 144 top
MIN7  33,31.12 138 top
MIN8  31.12,33 132 top
MIN9  29.45,35.07 126 top
MIN10  28,37.3 120 top
MIN11  26.8,39.67 114 top
MIN12  25.84,42.15 108 top
MIN13  25.16,44.72 102 top
MIN14  24.74,47.34 96 top
MIN15  24.6,50 90 top
MIN16  24.74,52.66 84 top
MIN17  25.16,55.28 78 top
MIN18  25.84,57.85 72 top
MIN19  26.8,60.33 66 top
MIN20  28,62.7 60 top
MIN21  29.45,64.93 54 top
MIN22  31.12,67 48 top
MIN23  33,68.88 42 top
MIN24  35.07,70.55 36 top
MIN25  37.3,72 30 top
MIN26  39.67,73.2 24 top
MIN27  42.15,74.16 18 top
MIN28  44.72,74.84 12 top
MIN29  47.34,75.26 6 top
MIN30  50,75.4 0 top
MIN31  52.66,75.26 354 top
MIN32  55.28,74.84 348 top
MIN33  57.85,74.16 342 top
MIN34  60.33,73.2 336 top
MIN35  62.7,72 330 top
MIN36  64.93,70.55 324 top
MIN37  67,68.88 318 top
MIN38  68.88,67 312 top
MIN39  70.55,64.93 306 top
MIN40  72,62.7 300 top
MIN41  73.2,60.33 294 top
MIN42  74.16,57.85 288 top
MIN43  74.84,55.28 282 top
MIN44  75.26,52.66 276 top
MIN45  75.4,50 270 top
MIN46  75.26,47.34 264 top
MIN47  74.84,44.72 258 top
MIN48  74.16,42.15 252 top
MIN49  73.2,39.67 246 top
MIN50  72,37.3 240 top
MIN51  70.55,35.07 234 top
MIN52  68.88,33 228 top
MIN53  67,31.12 222 top
MIN54  64.93,29.45 216 top
MIN55  62.7,28 210 top
MIN56  60.33,26.8 204 top
MIN57  57.85,25.84 198 top
MIN58  55.28,25.16 192 top
MIN59  52.66,24.74 186 top
PROG  87,18 90 bottom
Q1  29,14 270 bottom
Q6  85,11 90 bottom
Q7  85,7 90 bottom
R1  43,42.5 135 bottom
R2  44.5,41 135 bottom
R3  51.8,37.6 45 bottom
R4  53.3,39.1 45 bottom
R5  54.8,40.6 45 bottom
R6  56.3,42.1 45 bottom
R7  60.6,46.3 45 bottom
R8  59.1,44.8 45 bottom
R9  58.6,57.3 315 bottom
R10  60.1,55.8 315 bottom
R11  61.4,51.6 45 bottom
R12  41.5,44 135 bottom
R13  43.4,55.6 225 bottom
R16  40,60.9 315 bottom
R23  94.2,15 0 bottom
R27  37.9,59.1 225 bottom
R28  74.6,16 270 bottom
R29  71.8,15.5 180 bottom
R30  81,13 0 bottom
R31  94.2,18 0 bottom
R32  81,10.5 0 bottom
R33  81,8 180 bottom
R34  81,5.5 180 bottom
R36  94.2,20.5 0 bottom
R43  94.2,23 0 bottom
SEC0  50,18.25 0 top
SEC1  46.68,18.42 354 top
SEC2  43.4,18.94 348 top
SEC3  40.19,19.8 342 top
SEC4  37.09,20.99 336 top
SEC5  34.12,22.5 330 top
SEC6  31.34,24.31 324 top
SEC7  28.76,26.41 318 top
SEC8  26.41,28.76 312 top
SEC9  24.31,31.34 306 top
SEC10  22.5,34.12 300 top
SEC11  20.99,37.09 294 top
SEC12  19.8,40.19 288 top
SEC13  18.94,43.4 282 top
SEC14  18.42,46.68 276 top
SEC15  18.25,50 270 top
SEC16  18.42,53.32 264 top
SEC17  18.94,56.6 258 top
SEC18  19.8,59.81 252 top
SEC19  20.99,62.91 246 top
SEC20  22.5,65.88 240 top
SEC21  24.31,68.66 234 top
SEC22  26.41,71.24 228 top
SEC23  28.76,73.59 222 top
SEC24  31.34,75.69 216 top
SEC25  34.12,77.5 210 top
SEC26  37.09,79.01 204 top
SEC27  40.19,80.2 198 top
SEC28  43.4,81.06 192 top
SEC29  46.68,81.58 186 top
SEC30  50,81.75 180 top
SEC31  53.32,81.58 174 top
SEC32  56.6,81.06 168 top
SEC33  59.81,80.2 162 top
SEC34  62.91,79.01 156 top
SEC35  65.88,77.5 150 top
SEC36  68.66,75.69 144 top
SEC37  71.24,73.59 138 top
SEC38  73.59,71.24 132 top
SEC39  75.69,68.66 126 top
SEC40  77.5,65.88 120 top
SEC41  79.01,62.91 114 top
SEC42  80.2,59.81 108 top
SEC43  81.06,56.6 102 top
SEC44  81.58,53.32 96 top
SEC45  81.75,50 90 top
SEC46  81.58,46.68 84 top
SEC47  81.06,43.4 78 top
SEC48  80.2,40.19 72 top
SEC49  79.01,37.09 66 top
SEC50  77.5,34.12 60 top
SEC51  75.69,31.34 54 top
SEC52  73.59,28.76 48 top
SEC53  71.24,26.41 42 top
SEC54  68.66,24.31 36 top
SEC55  65.88,22.5 30 top
SEC56  62.91,20.99 24 top
SEC57  59.81,19.8 18 top
SEC58  56.6,18.94 12 top
SEC59  53.32,18.42 6 top
SPECIAL0  48,37 0 top
SPECIAL3  37,50 90 top
SPECIAL5  48,63 0 top
SPECIAL6  52,63 0 top
SPECIAL9  63,50 270 top
SPECIAL11  52,37 0 top
U2  38.6,46.4 225 bottom
U$1  50,50 225 top
U$2  45.5,58 225 bottom
U$3  [TIMEARC_KEEPOUT]  0,0 0 top
U$11  44.9,56.2 45 top
U$12  73,6 90 bottom
U$13  USBLC6-2SC6  [SOT23']  73.5,12.5 0 bottom
Y1  48.9,53.1 315 bottom

### Tracks (layer width: path | path; a pad name or v marks a point on that pad's centre or on a via)
+3V3  (via drill 0.31)
  Top 0.203: U$1.32 v49.8,44.5 | U$1.48 v55.6,49.7 | U$1.64 v50.3,55.6 49.7,55.6 U$1.1 | v80.5,4 56.5,4 56,4.5 v56,5.5 | v37.2,42.1 v34,45.3 | v43.1,54.2 43.1,53.8 44.34,52.56 U$1.13 44.34,52.46 45.2,51.6 45.2,50.5 v45.3,50.4 45.1,50.6 41.6,50.6 41.2,51 37.4,51 36.4,52 v35,52 | U$1.19 44.08,47.98 45.3,49.2
  Top 0.406: v49.8,44.5 50,44.3 v50,42 | v52.2,8.06 51.99,12.05 51,34 50,35 v50,36.3
  Bottom 0.203: v45.3,50.4 45.4,50.4 C2.1 | v49.8,44.5 49.8,44.6 C1.1 | v55.6,49.7 55.5,49.7 C4.1 | v50.3,55.6 50.9,55.2 C3.1 | 88,11 Q6.3 86,11.1 86,14 84.54,15.46 PROG.P$1 | 88,11 92,11 94.7,13.5 94.7,14.65 R23.1 94.7,15 94.7,17.65 R31.1 94.7,18 94.7,20.15 R36.1 94.7,20.5 94.7,22.65 R43.1 | 88,11 88,6 86,4 v80.5,4 80,4.5 80,5 80.15,5.15 R34.1 | v56,5.5 56,7.9 IC1.4 | U2.6 35.04,47.04 35,47 | C27.1 39.13,44.1 U2.1 39.24,44.14 38.2,43 v37.2,42.1 | v34,45.3 34,46 35,47 | 35,47 | R27.1 37.9,60.3 R16.2 39.8,59.9 39.8,58.5 38.9,57.6 38.9,56.8 39.7,56 40.2,56 40.5,56.3 40.9,56.3 43,54.2 v43.1,54.2 | 35,47 35,51 v35,52 | 35,47 | 35,47 C5.1
  Bottom 0.406: C17.1 49.05,8.85 IC1.2 52.14,8 v52.2,8.06 IC1.4 56.1,9.9 56,10 60,10 C25.+ 61.5,10.5 62,11 65.85,11 | C8.1 68.15,11.15 68,11 66,11 | 66,11 65.85,11 | 65.85,11 C20.1 65.85,11.15 66,11 | v50,42 v50,36.3
  pour Top (isolate 0.305): 56,50 56,50.1 50,56.1 49.9,56.1 43.9,50.1 43.9,50 49.9,44 50,44
+5V  (via drill 0.31)
  Top 0.203: v63,9 77,9 v78.5,10.5
  Bottom 0.203: JP2.1 63,5 v63,9 | R32.2 v78.5,10.5 78.5,12.9 78.15,13.25 C11.1 75.85,12.6 74,12.6 73.5,13.1 U$13.5
  Bottom 0.406: JP1.2 21.3,3.7 22,3 34,3 | 34,3 34.54,3.44 34.54,4.54 36,6 36,8 37,9 39,9 | C24.+ 39,9 | 39,9 41.85,9 C18.1 42,9 44.35,9 C23.1 44.5,9.5 45,10 49,10 49.31,10.31 IC1.3 | JP2.1 63.55,3.55 63,3 34,3
ADXL345_INT1  (via drill 0.31)
  Top 0.203: U$1.10 45.36,53.54 44.6,54.3 44.1,54.3 43.2,55.1 43,55.1 41.7,53.9 v40.9,53.9
  Bottom 0.203: v40.9,53.9 38.2,51.2 38.2,48.93 U2.8
ADXL345_INT2  (via drill 0.31)
  Top 0.203: U$1.9 45.76,53.94 45,54.7 44.3,54.7 43.4,55.6 42.6,55.6 v41.6,54.7
  Bottom 0.203: v41.6,54.7 41.8,54.4 41.7,53.7 38.9,50.9 38.9,48.2 38.73,48.33 U2.9
ARCDOZEN_1
  Top 0.203: MIN0.C 50,21.5 | 50,21.5 SEC0.C | 48.51,21.54 arc-21 38.41,23.96 MIN4.C SEC4.C | 48.51,21.54 arc3 50,21.5 | SEC1.C MIN1.C 47.02,21.66 | SEC2.C 44.06,22.07 | 44.06,22.07 MIN2.C 44.08,22.14 arc3 47.02,21.66 | SEC3.C MIN3.C 41.2,22.91 arc3 44.06,22.07 | HOUR0.C 50,30 arc-3 48.95,30.03 | 48.95,30.03 48.51,21.54 | 47.02,21.66 arc3 50,21.5 | 48.95,30.03 49,30.07 49,33 47,35 47,37 47.85,38 SPECIAL0.C 48,40 45.6,42.4 45.6,43.9 46.75,45.05 U$1.27
ARCDOZEN_2
  Top 0.203: SEC5.C MIN5.C 35.75,25.32 | 26.94,33.25 arc24 35.75,25.32 | SEC6.C 33.25,26.94 | 33.25,26.94 | 33.25,26.94 MIN6.C 33.25,26.94 arc3 35.75,25.32 | SEC7.C MIN7.C 30.93,28.81 | SEC8.C MIN8.C 28.82,30.92 arc3 30.92,28.8 31.05,28.95 30.93,28.81 | SEC9.C 26.94,33.25 | 30.93,28.81 arc3 33.25,26.94 | MIN9.C 26.94,33.25 | HOUR1.C 39.11,33.23 38.97,33.02 | 38.97,33.02 34.46,26.11 arc0 33.25,26.94 | U$1.26 46.4,45.4 44.6,43.6 44.6,40.7 41,36 38.97,33.02
ARCDOZEN_3
  Top 0.203: 25.32,35.75 SEC10.C | 25.32,35.75 MIN10.C 25.32,35.75 | 25.32,35.75 arc-3 24.61,37.06 | 24.61,37.06 arc-21 21.66,47.02 MIN14.C SEC14.C | SEC11.C MIN11.C 23.97,38.41 | SEC12.C MIN12.C 22.9,41.2 | SEC13.C MIN13.C 22.12,44.07 arc3 22.9,41.2 | 23.97,38.41 arc3 25.32,35.75 | 22.9,41.2 arc3 23.97,38.41 | HOUR2.C 32.18,40.92 32.07,40.86 | 32.07,40.86 24.61,37.06 | U$1.17 41.79,48.59 40.7,47.5 40.7,41.7 40.4,41.4 36.5,41.4 35.4,42.6 32.2,40.9 32.07,40.86
ARCDOZEN_4
  Top 0.203: 21.5,50 arc-3 21.54,51.49 | 21.54,51.49 arc-21 23.96,61.59 MIN19.C SEC19.C | MIN15.C 21.5,50 | 21.5,50 21.48,49.99 | 21.48,49.99 SEC15.C | 21.65,52.98 MIN16.C 21.65,52.98 arc3 21.48,49.99 | 21.65,52.98 SEC16.C | SEC17.C MIN17.C 22.13,55.93 | SEC18.C MIN18.C 22.9,58.8 arc3 22.13,55.93 | 22.13,55.93 arc3 21.65,52.98 | HOUR3.C 30.03,51.05 | 30.03,51.05 21.54,51.49 | U$1.16 42.6,52.1 39.9,52.1 39,53 34,53 | 34,53 32,53 31.08,52.1 30.03,51.05 | SPECIAL3.C 35,50 34,51 34,53
ARCDOZEN_5
  Top 0.203: 25.32,64.25 arc-24 33.25,73.06 | 25.32,64.25 SEC20.C | 26.94,66.75 MIN21.C 26.94,66.75 arc3 25.32,64.25 | 26.94,66.75 26.96,66.71 | 26.96,66.71 SEC21.C | SEC22.C MIN22.C 28.82,69.07 | SEC23.C MIN23.C 30.94,71.17 arc3 28.82,69.07 | 33.25,73.06 SEC24.C | 28.82,69.07 28.83,69.06 arc3 26.94,66.75 | MIN24.C 33.25,73.06 | HOUR4.C 33.23,60.89 | 33.23,60.89 26.1,65.52 26.96,66.71 | U$1.15 42.6,52.6 40.2,52.6 36,56.8 36,59.2 33.23,60.89 | MIN20.C 25.32,64.25
ARCDOZEN_6
  Top 0.203: 35.75,74.68 arc-24 47.02,78.34 MIN29.C SEC29.C | MIN25.C 35.75,74.68 | 35.75,74.68 SEC25.C | 38.41,76.04 MIN26.C 38.42,76.01 arc3 35.75,74.68 | 38.41,76.04 SEC26.C | SEC27.C MIN27.C 41.19,77.1 | SEC28.C MIN28.C 44.08,77.86 arc3 41.19,77.1 | 41.19,77.1 arc3 38.41,76.04 | 35.75,74.68 arc-2 37.06,75.39 40.92,67.82 HOUR5.C 39.3,66.9 40.8,64 | U$1.14 43.99,52.21 42.9,53.2 40.4,53.2 36.6,57 36.6,59.8 40.8,64 | 40.8,64 42,64 43,65 47,65 48,64 48.15,64 SPECIAL5.C
ARCDOZEN_7
  Top 0.203: 50,78.5 arc-24 61.59,76.04 MIN34.C SEC34.C | MIN30.C 50,78.5 | 50,78.5 | 50,78.5 SEC30.C | 52.98,78.35 MIN31.C 52.98,78.34 | 52.98,78.35 SEC31.C | 55.92,77.88 MIN32.C 55.92,77.88 arc3 52.98,78.35 | 55.92,77.88 SEC32.C | SEC33.C MIN33.C 58.8,77.09 arc3 55.92,77.88 | 52.98,78.34 arc5 50,78.5 | HOUR6.C 50.93,69.97 | 50.93,69.97 51.05,69.97 51.49,78.46 52.98,78.34 | U$1.62 52.12,56.12 53,57 53,64 | 53,64 53,67.9 50.93,69.97 | SPECIAL6.C 52,64 53,64
ARCDOZEN_8
  Top 0.203: 64.25,74.68 arc-24 73.06,66.75 MIN39.C SEC39.C | MIN35.C 64.25,74.68 | 64.25,74.68 SEC35.C | 66.76,73.06 MIN36.C 66.76,73.06 | 66.76,73.06 SEC36.C | 69.06,71.19 MIN37.C 69.07,71.19 arc3 66.76,73.06 | 69.06,71.19 SEC37.C | SEC38.C MIN38.C 71.18,69.07 arc3 69.06,71.19 | 66.76,73.06 arc3 64.25,74.68 | HOUR7.C 60.89,66.77 | 60.89,66.77 65.52,73.9 66.76,73.06 | U$1.61 52.58,55.77 59.2,62.4 59.2,64 59.3,64.07 60.89,66.77
ARCDOZEN_9
  Top 0.203: 78.34,52.98 arc24 74.68,64.25 | MIN40.C 74.68,64.25 | 74.68,64.25 SEC40.C | 76.04,61.59 MIN41.C 76.03,61.59 arc3 74.68,64.25 | 76.04,61.59 SEC41.C | SEC42.C MIN42.C 77.1,58.8 | SEC43.C MIN43.C 77.88,55.92 arc3 77.1,58.8 | SEC44.C 78.34,52.98 | 77.1,58.8 arc3 76.04,61.59 | MIN44.C 78.34,52.98 | HOUR8.C 67.82,59.08 67.93,59.14 | 67.93,59.14 75.39,62.94 74.68,64.25 | U$1.59 54.9,56.6 55.4,57.1 63.8,57.1 67.93,59.14
ARCDOZEN_10  (via drill 0.31)
  Top 0.203: 78.5,50 arc-24 76.04,38.41 MIN49.C SEC49.C | SEC45.C 78.5,50 | 78.5,50 | 78.5,50 MIN45.C | 78.35,47.03 MIN46.C 78.35,47.02 | 78.35,47.03 SEC46.C | SEC47.C 77.88,44.07 | 77.88,44.07 MIN47.C 77.87,44.08 arc3 78.35,47.03 | SEC48.C MIN48.C 77.1,41.2 arc3 77.88,44.07 | 78.35,47.02 arc3 78.5,50 | HOUR9.C 69.97,48.95 | 69.97,48.95 78.46,48.51 78.35,47.02 | U$1.58 55,55.9 v55.3,55.9 | 69.97,48.95 v65.9,49 64.9,50 SPECIAL9.C
  Bottom 0.203: v55.3,55.9 55.4,56 62.4,49 v65.9,49
ARCDOZEN_11  (via drill 0.31)
  Top 0.203: 74.68,35.75 arc-24 66.75,26.94 MIN54.C SEC54.C | SEC50.C 74.68,35.75 | 74.68,35.75 MIN50.C | SEC51.C MIN51.C 73.06,33.25 | SEC52.C 71.18,30.93 | 71.18,30.93 MIN52.C 71.17,30.94 arc3 73.06,33.25 | SEC53.C MIN53.C 69.07,28.83 arc3 71.18,30.93 | 73.06,33.25 arc3 74.68,35.75 | HOUR10.C 66.77,39.11 | 66.77,39.11 73.9,34.48 74.68,35.75 | U$1.38 53.18,45.02 54.4,43.7 v54.9,43.6 | v61.8,42.6 61.77,42.6 66.77,39.11
  Bottom 0.203: v54.9,43.6 55.1,44 58.1,44 59.5,42.6 v61.8,42.6
ARCDOZEN_12  (via drill 0.31)
  Top 0.203: 52.98,21.66 arc21 62.94,24.61 | 62.94,24.61 arc3 64.25,25.32 | SEC55.C MIN55.C 64.25,25.32 | SEC56.C MIN56.C 61.59,23.96 | SEC57.C MIN57.C 58.8,22.9 | SEC58.C MIN58.C 55.92,22.15 arc3 58.8,22.9 | SEC59.C 52.98,21.66 | 61.59,23.96 arc3 64.25,25.32 | 58.8,22.9 arc3 61.59,23.96 | MIN59.C 52.98,21.66 | HOUR11.C 59.08,32.18 59.14,32.07 | 59.14,32.07 62.94,24.61 | 62.94,24.61 64.25,25.33 64.29,25.28 64.25,25.36 | U$1.37 52.8,44.7 52.2,45.3 52,45.3 50.8,44.1 v50.8,42.6 | v50.8,39.9 51,39.9 52,38.9 | 52,38.9 54.6,38.9 57.7,35.9 57.7,34.1 59.14,32.07 | SPECIAL11.C 52,38.9
  Bottom 0.203: v50.8,42.6 v50.8,39.9
DOZEN1  (via drill 0.31)  (9 unrouted)
  Top 0.203: HOUR0.A v50,33 | v41.5,35.28 HOUR1.A | HOUR2.A v35.28,41.5 35.78,41 v41.5,41 | HOUR3.A v33,50 | HOUR9.A v67,50 | HOUR6.A v50,67 | HOUR4.A v35.28,58.5 | HOUR5.A v41.5,64.72 | HOUR7.A v58.5,64.72 | HOUR8.A v64.72,58.5 | HOUR10.A v64.72,41.5 | HOUR11.A v58.5,35.28
  Bottom 0.203: 50,68 arc-180 50,32 v50,33 | 50,68 arc150 41,34.41 v41.5,35.28 | v35.28,41.5 34.42,41 | v33,50 32,50 | v67,50 68,50 | v50,67 50,68 | v35.28,58.5 34.42,58.99 | v41.5,64.72 41,65.58 | v58.5,64.72 59,65.59 | v64.72,58.5 65.59,59 | v64.72,41.5 65.59,41 | v58.5,35.28 58.99,34.42 | R1.1 v41.5,41
DOZEN2  (via drill 0.31)  (9 unrouted)
  Top 0.203: MIN0.A v50,27 | v38.5,30.08 MIN5.A | MIN10.A v30.08,38.5 | MIN15.A v27,50 | MIN20.A v30.08,61.5 | MIN25.A v38.5,69.92 | MIN30.A v50,73 | MIN35.A v61.5,69.92 | MIN40.A v69.92,61.5 | MIN45.A v73,50 | MIN50.A v69.92,38.5 | MIN55.A v61.5,30.08 | v40.8,37 v39,34.8
  Bottom 0.203: v50,27 arc330 v38.5,30.08 | v30.08,38.5 arc30 v38.5,30.08 | v38.5,30.08 | v39,34.8 37.5,30.7 v38.5,30.08 | R2.1 v40.8,37
DOZEN3  (via drill 0.31)  (10 unrouted)
  Top 0.203: MIN1.A v47.7,28.12 48,28.42 v48,33 | v37.07,32.2 MIN6.A | MIN11.A v29.9,41.05 | MIN16.A v28.12,52.3 | MIN21.A v32.21,62.93 | MIN26.A v41.05,70.1 | MIN31.A v52.3,71.88 | MIN36.A v62.93,67.8 | MIN41.A v70.1,58.95 | MIN46.A v71.88,47.7 | MIN51.A v67.8,37.07 | MIN56.A v58.95,29.9
  Bottom 0.203: v47.7,28.12 arc330 v37.07,32.2 | R3.1 52.3,37 52,37 v48,33
DOZEN4  (via drill 0.31)  (12 unrouted)
  Top 0.203: v45.63,29.46 MIN2.A | v35.95,34.39 MIN7.A | MIN12.A v30.03,43.51 | MIN17.A v29.46,54.37 | MIN22.A v34.39,64.05 | MIN27.A v43.51,69.97 | MIN32.A v54.37,70.54 | MIN37.A v64.05,65.61 | MIN42.A v69.97,56.49 | MIN47.A v70.54,45.63 | MIN52.A v65.61,35.95 | MIN57.A v56.49,30.03 55.6,33.32 v56,34
  Bottom 0.203: v45.63,29.46 arc330 v35.95,34.39 | R4.1 53.9,36.1 v56,34
DOZEN5  (via drill 0.31)  (10 unrouted)
  Top 0.203: v43.82,30.98 MIN3.A | v35.14,36.62 MIN8.A | MIN13.A v30.44,45.84 | MIN18.A v30.98,56.18 | MIN23.A v36.62,64.86 | MIN28.A v45.84,69.56 | MIN33.A v56.18,69.02 | MIN38.A v64.86,63.38 | MIN43.A v69.56,54.16 | MIN48.A v69.02,43.82 | MIN53.A v63.38,35.14 | MIN58.A v54.16,30.44 54,30.59 54,34 v56,36
  Bottom 0.203: v43.82,30.98 arc330 v35.14,36.62 | R5.1 55.4,39.6 56,39 v56,36
DOZEN6  (via drill 0.31)  (10 unrouted)
  Top 0.203: v42.27,32.64 MIN4.A | v34.63,38.83 MIN9.A | MIN14.A v31.1,48.01 | MIN24.A v38.83,65.37 | MIN34.A v57.73,67.36 | MIN39.A v65.37,61.17 | MIN44.A v68.9,51.99 | MIN49.A v67.36,42.27 | MIN54.A v61.17,34.63 61,34.8 58,39.3 v58.3,39.7 | MIN59.A v51.99,31.1 | MIN29.A v48.26,68.9 | MIN19.A v32.64,57.73
  Bottom 0.203: v42.27,32.64 arc330 v34.63,38.83 | R6.1 56.9,41.1 v58.3,39.7 | v48.26,68.9 48.1,68.9
DOZEN7  (via drill 0.31)  (11 unrouted)
  Top 0.203: v50,16 SEC0.A | v33,20.55 SEC5.A | SEC10.A v20.55,33 | SEC15.A v16,50 | SEC20.A v20.55,67 | SEC25.A v33,79.44 | SEC30.A v50,84 | SEC35.A v67,79.44 | SEC40.A v79.44,67 | SEC45.A v84,50 | SEC50.A v79.44,33 | v67,20.55 SEC55.A 67,20.6 | v66,46.2 v76,43
  Bottom 0.203: v50,16 arc330 v33,20.55 | R7.1 64.5,45.7 v66,46.2 | v76,43 82.8,41.2
DOZEN8  (via drill 0.31)  (10 unrouted)
  Top 0.203: v46.34,15.19 SEC1.A | v29.43,21.68 SEC6.A | SEC11.A v18.03,35.76 | SEC16.A v15.19,53.66 | SEC21.A v21.68,70.57 | SEC26.A v35.76,81.97 | SEC31.A v53.66,84.81 | SEC36.A v70.57,78.32 | SEC41.A v81.97,64.24 | SEC46.A v84.81,46.34 | v78.32,29.43 SEC51.A 74.1,30.3 v72.7,31.3 | SEC56.A v64.24,18.03 | v60.7,43.3 60.7,41.9 67.2,36.3 v71.5,32.4
  Bottom 0.203: v46.34,15.19 arc330 v29.43,21.68 | R8.1 59.8,44.2 v60.7,43.3 | v71.5,32.4 v72.7,31.3
DOZEN9  (via drill 0.31)  (10 unrouted)
  Top 0.203: v42.52,14.79 SEC2.A | v25.91,23.25 SEC7.A | SEC12.A v15.76,38.88 | SEC17.A v14.79,57.48 | SEC22.A v23.25,74.09 | SEC27.A v38.88,84.24 | SEC32.A v57.48,85.21 | SEC37.A v74.09,76.75 | v84.24,61.12 SEC42.A 79.4,61.1 v77.29,60.41 | SEC47.A v85.21,42.52 | SEC52.A v76.75,25.91 | SEC57.A v61.12,15.76 | v64,55.3 v75.8,59.8
  Bottom 0.203: v42.52,14.79 arc330 v25.91,23.25 | R9.1 61.9,57.9 v64,55.3 | v75.8,59.8 v77.29,60.41
DOZEN10  (via drill 0.31)  (10 unrouted)
  Top 0.203: v38.57,14.81 SEC3.A | v22.5,25.24 SEC8.A | SEC13.A v13.81,42.31 | SEC18.A v14.81,61.43 | SEC23.A v25.24,77.5 | SEC28.A v42.31,86.19 | SEC33.A v61.43,85.19 | SEC38.A v77.5,74.76 | v86.19,57.69 SEC43.A 80.3,58 v78.5,57.5 | SEC48.A v85.19,38.57 | SEC53.A v74.76,22.5 | SEC58.A v57.69,13.81 | v61.6,55.5 63.5,53.6 v76.6,57.1
  Bottom 0.203: v38.57,14.81 arc330 v22.5,25.24 | R10.1 v61.6,55.5 | v76.6,57.1 v78.5,57.5
DOZEN11  (via drill 0.31)  (10 unrouted)
  Top 0.203: v34.54,15.29 SEC4.A | v19.26,27.66 SEC9.A | SEC14.A v12.21,46.03 | SEC24.A v27.66,80.74 | SEC34.A v65.46,84.72 | SEC39.A v80.74,72.34 | v87.79,53.97 SEC44.A 81.71,52.2 v67,51.2 | SEC49.A v84.72,34.54 | SEC54.A v72.34,19.26 | SEC59.A v53.97,12.21 | SEC19.A v15.29,65.46
  Top 0.305: SEC29.A v46.03,87.79
  Bottom 0.203: v34.54,15.29 arc330 v19.26,27.66 | R11.1 63,50 v67,51.2
DOZEN12  (via drill 0.31)  (1 unrouted)
  Top 0.203: SPECIAL6.A SPECIAL5.A 47.65,62.15 46,64 42.8,64 42.1,63.3 40.8,63.3 37.1,59.6 37.1,57.2 39.3,55 v40,55 | 51.15,37 49,37 48.15,36.15 SPECIAL0.A v48,35 | v36,51.3 36.55,51.3 SPECIAL3.A 40.2,50 40.5,49.5 40.5,48 39.6,47 v39.7,42.2 | SPECIAL11.A 54.15,36.15 55,37 56,37 57,36 v57,35.3 | v66,50 65,51 63.15,51 SPECIAL9.A
  Bottom 0.203: v48,35 47,36 39.8,36 37.6,38.2 37.6,40.1 v39.7,42.2 R12.1 | v40,55 40,54.4 36.9,51.3 v36,51.3 | R12.1 | v57,35.3 57,36 65,44 66,44 66.5,44.5 66.5,45 66.9,45.4 66.9,49.1 v66,50
GND  (via drill 0.31)
  Top 0.203: v46.5,51.7 46.3,51.9 45.6,51.9 44.7,52.8 U$1.12 44.67,52.83 | U$1.28 47.2,44.7 v48.3,45.8 49,45.1 49,44.4 U$1.31 | U$1.47 55.7,48.9 v54.9,48.9 | U$1.60 52.8,55.3 v51.6,54.1 51.1,54.6 51.1,55.7 U$1.63 | U$11.2 v46.1,57.4 | U$1.18 44.3,48.9 44.3,49.1 v43.5,49.9
  Bottom 0.203: v46.5,51.7 C2.2 | v48.3,45.8 48.6,45.8 C1.2 | v54.9,48.9 53.9,48.9 C4.2 | v51.6,54.1 52.1,53.4 C3.2 | U$13.2 73.5,12 73,12.5 71,12.5 | FTDI.6 26,7 | U2.5 C5.2 | v46.1,57.4 46.1,57.8 | v43.5,49.9 43.3,49.9 | U2.4 37.54,45.94 38.2,46.6 39.2,45.6 39.2,45.3 U2.2
  Bottom 0.406: C24.- 39,5 42,5 | 42,5 44.5,5 | 44.5,5 47,5 | 47,5 49,5 | 49,5 49.21,5 IC1.1 49.69,5.69 49,5 | C18.2 42,5 | C23.2 44.5,5 | C17.2 47,5 | FTDI.5 FTDI.6 | 60,5 C25.- | U$12.MTN3 68.5,8 | 68.5,8 U$12.MTN4 | U$12.GND 69,8.5 68.5,8 | U$12.MTN1 U$12.MTN2
  other vias: 52,81 34.5,12 96,10 96,4 4,4 4,10 75.4,10.4 70.5,10.5 87,9 60,49 50,65.5 46,34 52.5,34.5 65.5,52.5 62,39.3 60.5,37.5 83,26 17,28 21,42 23.5,42.7 30.5,30.5 69.5,69.5 64.5,56.5 59.8,24.3 22.9,54.4 28.6,67.3 50,61 49,39 65,47 35.5,55.5 39.5,38.5 57.7,47.7 46,37 34.4,43.2 54.3,22.9 57.1,23.5 67.2,28.7 56,62 78.5,14.5
  pour Bottom (isolate 0.305): 56,50 50,44 49.9,44 43.9,50 43.9,50.1 49.9,56.1 50,56.1 56,50.1
  pour Bottom (isolate 0.305): 0,0 0,100 100,100 100,0
  pour Top (isolate 0.305, rank 2): 0,0 0,100 100,100 100,0
LIGHT_SENSOR  (via drill 0.31)
  Top 0.203: U$1.8 46.11,54.29 45.2,55.2 44.9,55.2 U$11.1 42.74,57.3 v38.1,57.3
  Bottom 0.203: R27.2 v38.1,57.3
N$1  (via drill 0.31)
  Top 0.203: U$1.6 46.85,54.95 v47.8,54
  Bottom 0.203: v47.8,54 47.8,53.8 47.5,53.5 47.5,52.8 Y1.3
N$2  (via drill 0.31)
  Top 0.203: U$1.5 47.2,55.3 47.8,54.7 v48.5,54.7
  Bottom 0.203: v48.5,54.7 49,54.7 Y1.1
N$3
  Bottom 0.406: U$12.VBUS 74.6,7.1 74,6.5 74,1 67,1 64.45,3.55 JP2.2
N$4  (via drill 0.31)
  Top 0.203: U$1.4 47.52,55.67 46.9,56.3 v46.8,56.4
  Bottom 0.203: v46.8,56.4 45.3,56.3 R13.2
N$5
  Bottom 0.203: C6.2 41,58 | 41,58 41,58.31 U$2.P$4 | 41,58 R13.1
N$6  (via drill 0.31)
  Top 0.203: U$1.3 47.88,56.02 47.5,56.4 47.5,56.9 45,59.4 v45,60
  Bottom 0.203: C7.1 45.39,62.21 U$2.P$1 46,61.11 v45,60
N$7  (via drill 0.31)
  Top 0.203: U$1.29 47,43.8 v46.8,43.8
  Bottom 0.203: v46.8,43.8 44.3,43.8 R1.2 | R1.2
N$8  (via drill 0.31)
  Top 0.203: U$1.30 v46.7,42.8
  Bottom 0.203: v46.7,42.8 46.4,42.9 R2.2 | R2.2
N$9  (via drill 0.31)
  Top 0.203: U$1.33 51.71,43.01 v51.7,42
  Bottom 0.203: v51.7,42 51.6,42 51.5,41.9 51.5,38.8 51.1,38.4 51,38.4 R3.2
N$10  (via drill 0.31)
  Top 0.203: U$1.34 v52.6,42.8
  Bottom 0.203: v52.6,42.8 52.6,39.4 R4.2
N$11  (via drill 0.31)
  Top 0.203: U$1.35 52.12,43.98 52.6,43.5 52.9,43.4 53.4,42.9 v53.4,41.9
  Bottom 0.203: v53.4,41.9 53.4,41.6 R5.2
N$12  (via drill 0.31)
  Top 0.203: U$1.36 52.48,44.33 52.9,43.9 53.3,43.9 v54.3,42.8
  Bottom 0.203: v54.3,42.8 R6.2
N$13  (via drill 0.31)
  Top 0.203: U$1.40 53.89,45.81 v52.9,46.8
  Bottom 0.203: v52.9,46.8 59.9,46.8 R7.2
N$14  (via drill 0.31)
  Top 0.203: U$1.39 53.6,45.4 54.3,44.7 v54.6,44.7
  Bottom 0.203: v54.6,44.7 54.7,44.7 55,45 58,45 58.4,45.2 | 58.4,45.2 | 58.4,45.2 58.4,45.6 58.5,45.5 R8.2
N$15  (via drill 0.31)
  Top 0.203: U$1.53 55.33,52.83 57,54.4 v57.9,54.4
  Bottom 0.203: v57.9,54.4 58.3,54.9 58.3,56.6 58.2,56.7 R9.2
N$16  (via drill 0.31)
  Top 0.203: U$1.52 55.67,52.48 56.8,53.7 58.7,53.7 v58.8,53.8
  Bottom 0.203: v58.8,53.8 R10.2
N$17  (via drill 0.31)
  Top 0.203: U$1.51 57,53 v60,53
  Bottom 0.203: v60,53 R11.2
N$18
  Bottom 0.203: U$12.D- 73.8,9.8 74.5,10.5 74.5,11.1 U$13.1
N$19
  Bottom 0.406: FTDI.4 21.27,5.48 JP1.1
N$20
  Bottom 0.203: FTDI.1 13.65,12.65 15,14 Q1.3
N$34
  Bottom 0.203: U$12.D+ 73,10 72.55,10.45 U$13.3
N$35  (via drill 0.31)
  Top 0.203: U$1.25 46.11,45.71 44.5,44.2 43.8,44.2 42.9,45.3 v42.9,45.4
  Bottom 0.203: v42.9,45.4 R12.2
N$36
  Bottom 0.203: R28.2 U$13.6
N$37
  Bottom 0.203: R29.2 U$13.4
N$38
  Bottom 0.203: R30.1 82.85,13 Q6.2
N$39
  Bottom 0.203: R32.1 83.45,10.5 Q6.1 83.95,10.05 86,8 86,7.1 Q7.3
N$40
  Bottom 0.203: R33.2 83.85,8 Q7.2
RST  (via drill 0.31)
  Top 0.203: U$1.7 46.46,54.64 v40.9,60.2
  Bottom 0.203: v40.9,60.2 40.9,60.9 R16.1
SPI1_MISO  (via drill 0.31)
  Top 0.203: U$1.22 45.02,46.82 44.7,46.5 44.7,46.1 44.3,45.7 43.6,45.7 41.9,47.4 v41.5,47.4
  Bottom 0.203: v41.5,47.4 41.3,47.4 U2.12
SPI1_MOSI  (via drill 0.31)
  Top 0.203: v46.4,47.3 46.24,47.3 U$1.23
  Bottom 0.203: U2.13 40.86,45.76 42,46.9 43.4,46.9 43.8,47.3 v46.4,47.3
SPI1_NSS  (via drill 0.31)
  Top 0.203: U$1.20 44.33,47.52 43.9,47.1 43.3,47.1 v42.5,47.9 | v39.8,49.3 39,48.7 v36.3,48.7
  Bottom 0.203: v42.5,47.9 41.1,49.3 v39.8,49.3 | v36.3,48.7 U2.7
SPI1_SCK  (via drill 0.31)
  Top 0.203: U$1.21 44.67,47.17 v43.9,46.4
  Bottom 0.203: v43.9,46.4 42.6,46.4 40.6,44.4 U2.14
TCK  (via drill 0.31)
  Top 0.203: v87,15.5 87,19 81.5,24.5 81.5,34.4 66.9,41.7 62,44.4 55.9,50.6 U$1.49
  Bottom 0.203: R23.2 93.29,15.46 PROG.P$2 87.04,15.46 v87,15.5
TDO  (via drill 0.31)
  Top 0.203: v91.5,20.6 87,20.6 85,22.6 85,33 85.8,33.8 85.8,36.5 v77.7,39.9 | v75.9,40.6 67.6,43.5 v65.8,44.9 | v62.4,44.9 60.9,46.4 60.9,53.3 58.3,56.2 57.3,56.2 U$1.55
  Bottom 0.203: R36.2 93.31,20.54 PROG.P$6 91.44,20.54 v91.5,20.6 | v77.7,39.9 v75.9,40.6 | v65.8,44.9 v62.4,44.9
TMS  (via drill 0.31)
  Top 0.203: U$1.46 56.02,47.88 59.8,44 61.8,44 80.9,33.6 80.9,23.3 v86.2,18
  Bottom 0.203: R31.2 PROG.P$4 v86.2,18
TOUCH1  (via drill 0.31)
  Top 0.203: U$1.50 57,52.4 57.4,52.4 v58.1,51.7 | v66,47.8 v77.3,45.6 | v79.1,45.3 87,44 87,37 v92.5,31.5
  Bottom 0.203: v58.1,51.7 58.3,51.7 62.2,47.8 v66,47.8 | v77.3,45.6 v79.1,45.3
  pour Top: 88,39 97,39 arc-90 98,38 98,25 arc-90 97,24 88,24 arc-90 87,25 87,38 arc-90
TOUCH2  (via drill 0.31)
  Top 0.203: U$1.11 44.5,53.7 v44.2,53.6 | v41.8,51.3 41.5,51.6 39.6,51.6 38.9,52.3 v37,52.3 | v37,54 v23.4,57.1 | v21.8,57.5 8,62 v7.5,69.5
  Bottom 0.203: v44.2,53.6 v41.8,51.3 | v37,52.3 v37,54 | v23.4,57.1 v21.8,57.5
  pour Top: 3,77 12,77 arc-90 13,76 13,63 arc-90 12,62 3,62 arc-90 2,63 2,76 arc-90
TOUCH3  (via drill 0.31)
  Top 0.203: U$1.24 45.71,46.11 44.6,45 v44.3,45 44.2,45 | v39,40 37.5,40 36,38.5 v28.8,32.7 | v27.3,31.5 19,25 10,25 v7.5,31.5
  Bottom 0.203: v44.3,45 44,45 v39,40 | v28.8,32.7 v27.3,31.5
  pour Top: 3,39 12,39 arc-90 13,38 13,25 arc-90 12,24 3,24 arc-90 2,25 2,38 arc-90
TOUCH4  (via drill 0.31)
  Top 0.203: U$1.54 57,55.2 57.2,55.4 v57.5,55.4 | v60,60 65,60 80.9,69.4 v92.5,69.5
  Bottom 0.203: v57.5,55.4 56.4,56.6 56.4,57.1 58.8,59.3 59.5,60 v60,60
  pour Top: 88,77 97,77 arc-90 98,76 98,63 arc-90 97,62 88,62 arc-90 87,63 87,76 arc-90
TOUCH5  (via drill 0.31)
  Top 0.203: U$1.57 v52.8,53.1 | v54,66 54,69 53,70 v54.3,77.3 | v54.7,79.6 56.1,90 v50,93.5
  Bottom 0.203: v52.8,53.1 52.8,64.8 v54,66 | v54.3,77.3 v54.7,79.6
  pour Top: 43.5,99 56.5,99 arc-90 57.5,98 57.5,89 arc-90 57,88 43.5,88 arc-90 42.5,89 42.5,98 arc-90
TRST  (via drill 0.31)
  Top 0.203: v84,23 84,32.9 85.4,34.2 85.4,35.6 85,36 v77.2,38.9 | v75.5,39.7 63.9,44.5 61.4,46.7 61.3,53.6 58.6,56.6 57,56.6 54.29,53.89 U$1.56
  Bottom 0.203: PROG.P$5 84.5,23 | 84.5,23 R43.2 | 84.5,23 v84,23 | v77.2,38.9 v75.5,39.7
USART1_RX  (via drill 0.31)
  Top 0.203: U$1.43 54.98,46.82 58.7,43 58.7,42.82 56.4,40.62 49.2,40.6 v49,40.4 | v18.75,5.35 32.35,5.35 33,6 33,16 42.89,35.2 44.69,38.8 46.6,38.8 v47,39
  Bottom 0.203: FTDI.3 18.73,7.63 18.5,7.5 18.7,7.7 v18.75,5.35 | v49,40.4 48.4,40.4 v47,39
USART1_TX  (via drill 0.31)
  Top 0.203: v32,15 44.5,39.4 v46.07,39.47 v46.07,39.48 | U$1.42 57.9,43.1 57.9,42.9 56.1,41.1 48.1,41.1 v48,41
  Bottom 0.203: FTDI.2 16.19,9.19 17,10 31,10 32,11 v32,15 | v48,41 47.59,41 v46.07,39.48
USB_DISCONNECT  (via drill 0.31)
  Top 0.203: v80,17 80,20 v70.7,29.3 | v69.6,30.4 v59.2,40.8 | U$1.41 54.24,46.06 56.9,43.4 56.9,43.1 v57,43
  Bottom 0.203: Q7.1 83.35,5.5 R34.2 81.5,5.5 81,6 81,16 v80,17 | v70.7,29.3 v69.6,30.4 | v59.2,40.8 v57,43
USB_DM  (via drill 0.31)
  Top 0.203: U$1.44 55.33,47.17 59.4,43.1 59.4,42.6 56.6,39.8 70.6,17.6 70.6,16.8 70.8,16.6 72,16.6 v74.6,18.5
  Bottom 0.203: v74.6,18.5 R28.1
USB_DP  (via drill 0.31)
  Top 0.203: U$1.45 55.67,47.52 59.9,43.3 59.8,42.4 57.1,39.7 v71.4,17.4
  Bottom 0.203: R29.1 70.95,16.45 71.3,16.8 | 71.3,16.8 73.1,16.8 73.9,16 79,16 80,15 80,13.15 R30.2 | v71.4,17.4 71.3,16.8
WAKE  (via drill 0.31)
  Top 0.203: U$1.2 47.9,56.7 47.9,58.1 v43,63 | v33,47 v23,45.6 | v21,45.3 13,44 13,40 15,38 v15,26
  Bottom 0.203: v43,63 39,63 36,60 36,58 34,56 34,48 v33,47 | v23,45.6 v21,45.3 | v15,26 15,18 18,15 30.05,15 Q1.1

### Text on the board
tPlace: XII | I | XI | II | X | III | IX | IV | VIII | V | VII | VI
bPlace: Time Arc / Armin Oonk, May 2014
tDocu: Ruimte om hex standoff / in de behuizing te verwerken | Hex standoff m3x40 farnell: 1466833